# EAGLE design powerblade_test (EAGLE 6.5.0)

## Sheet 1 of 5: AC-DC Power Supply
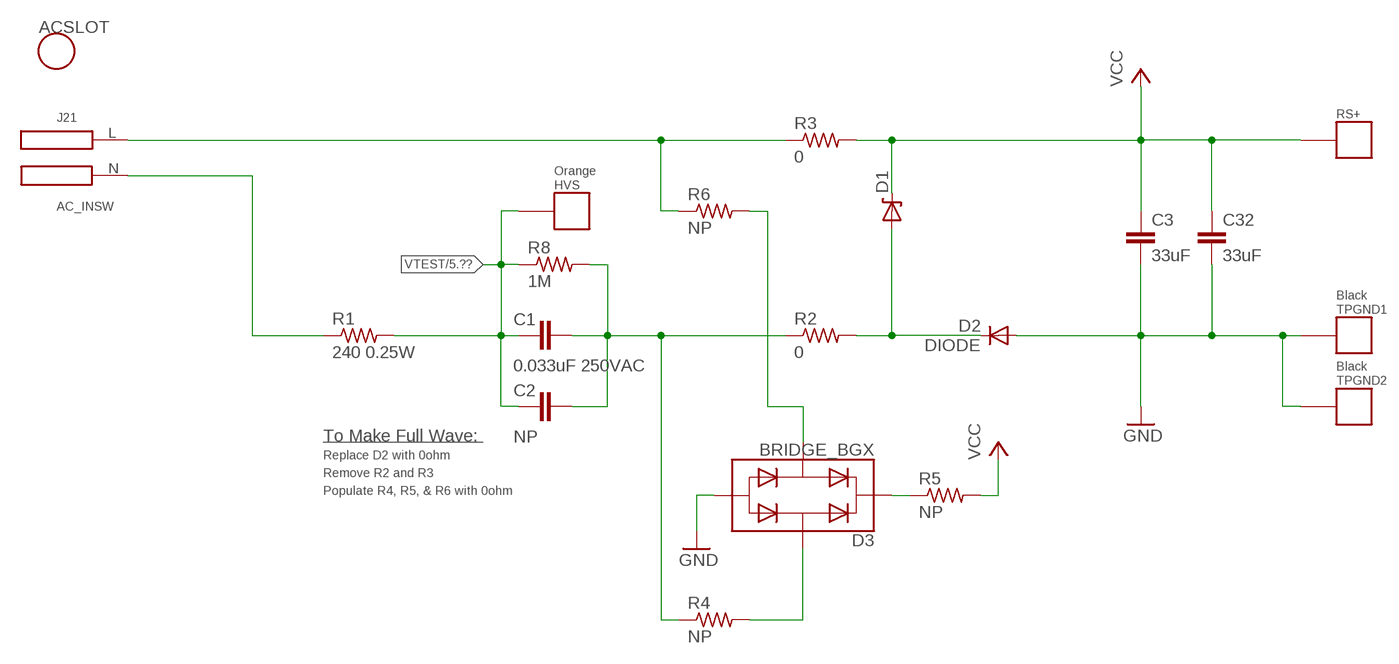
[diagram p0: schematic, sheet 1]

### Parts
ACSLOT  AC_NODIM  [AC3_NODIM]
C1  0.033uF 250VAC  C-EUC2220K  [C2220K]
C2  NP  C-EUC2220K  [C2220K]
C3  33uF  C-EUC0603  [C0603]
C32  33uF  C-EUC0603  [C0603]
D1  ZENERBZT52  [BZT52]
D2  DIODE  [BAS521]
D3  BRIDGE_BGX  [TO-253-4]
HVS  TP_MULT  [TP_MULT]
J21  AC_INSW  [AC_DC21]
R1  240 0.25W  R-US_R0603  [R0603]
R2  0  R-US_R0603  [R0603]
R3  0  R-US_R0603  [R0603]
R4  NP  R-US_R0603  [R0603]
R5  NP  R-US_R0603  [R0603]
R6  NP  R-US_R0603  [R0603]
R8  1M  R-US_R0603  [R0603]
RS+  TP_MULT  [TP_MULT]
TPGND1  TP_MULT  [TP_MULT]
TPGND2  TP_MULT  [TP_MULT]

### Nets
GND: C3.2 C32.2 D2.A D3.P3 TPGND1.P$1 TPGND2.P$1 ; also sheet 2,3,4,5
N: J21.N R1.1
N$3: D1.A D2.C R2.2
N$4: C1.1 C2.1 R2.1 R4.1 R8.2
N$5: D3.P4 R4.2
N$7: D3.P1 R5.1
N$8: D3.P2 R6.2
P: J21.L(P) R3.1 R6.1
VCC: C3.1 C32.1 D1.C R3.2 R5.2 RS+.P$1 ; also sheet 2,3
VTEST: C1.2 C2.2 HVS.P$1 R1.2 R8.1 ; also sheet 5

### Notes on the sheet
- Orange
- Black
- Black
- To Make Full Wave:
- Replace D2 with 0ohm
- Remove R2 and R3
- Populate R4, R5, & R6 with 0ohm

## Sheet 2 of 5: Load Supply Regulation
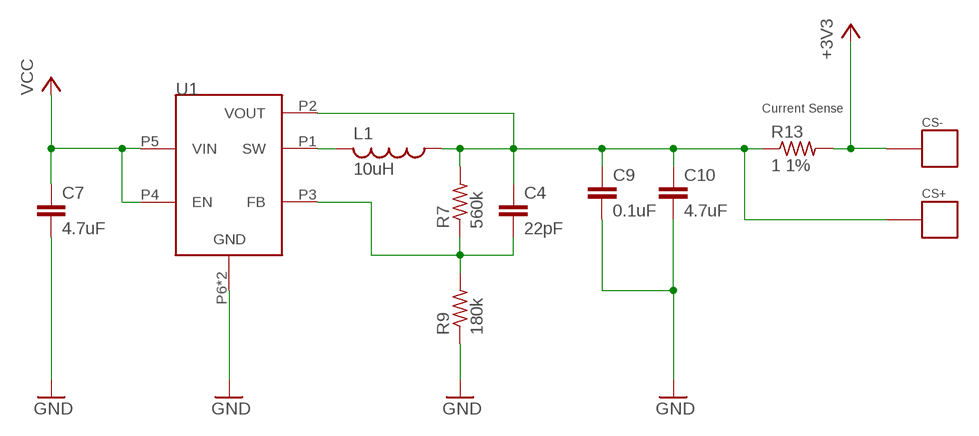
[diagram p1: schematic, sheet 2]

### Parts
C4  22pF  C-EUC0402  [C0402]
C7  4.7uF  C-EUC0603  [C0603]
C9  0.1uF  C-EUC0402  [C0402]
C10  4.7uF  C-EUC0402  [C0402]
CS+  TP_MULT  [TP_MULT]
CS-  TP_MULT  [TP_MULT]
L1  10uH  L-USL0805  [L0805]
R7  560k  R-US_R0402  [R0402]
R9  180k  R-US_R0402  [R0402]
R13  1 1%  R-US_R0603  [R0603]
U1  TPS62122  [WDFN-6]

### Nets
+3V3: CS-.P$1 R13.2 ; also sheet 3,4,5
GND: C7.2 C9.2 C10.2 R9.1 U1.P6(GND) U1.PAD(GND) ; also sheet 1,3,4,5
N$9: L1.2 U1.P1(SW)
N$11: C4.1 C9.1 C10.1 CS+.P$1 L1.1 R7.2 R13.1 U1.P2(VOUT)
N$13: C4.2 R7.1 R9.2 U1.P3(FB)
VCC: C7.1 U1.P4(EN) U1.P5(VIN) ; also sheet 1,3

### Notes on the sheet
- Current Sense

## Sheet 3 of 5: Load 1: TR1000
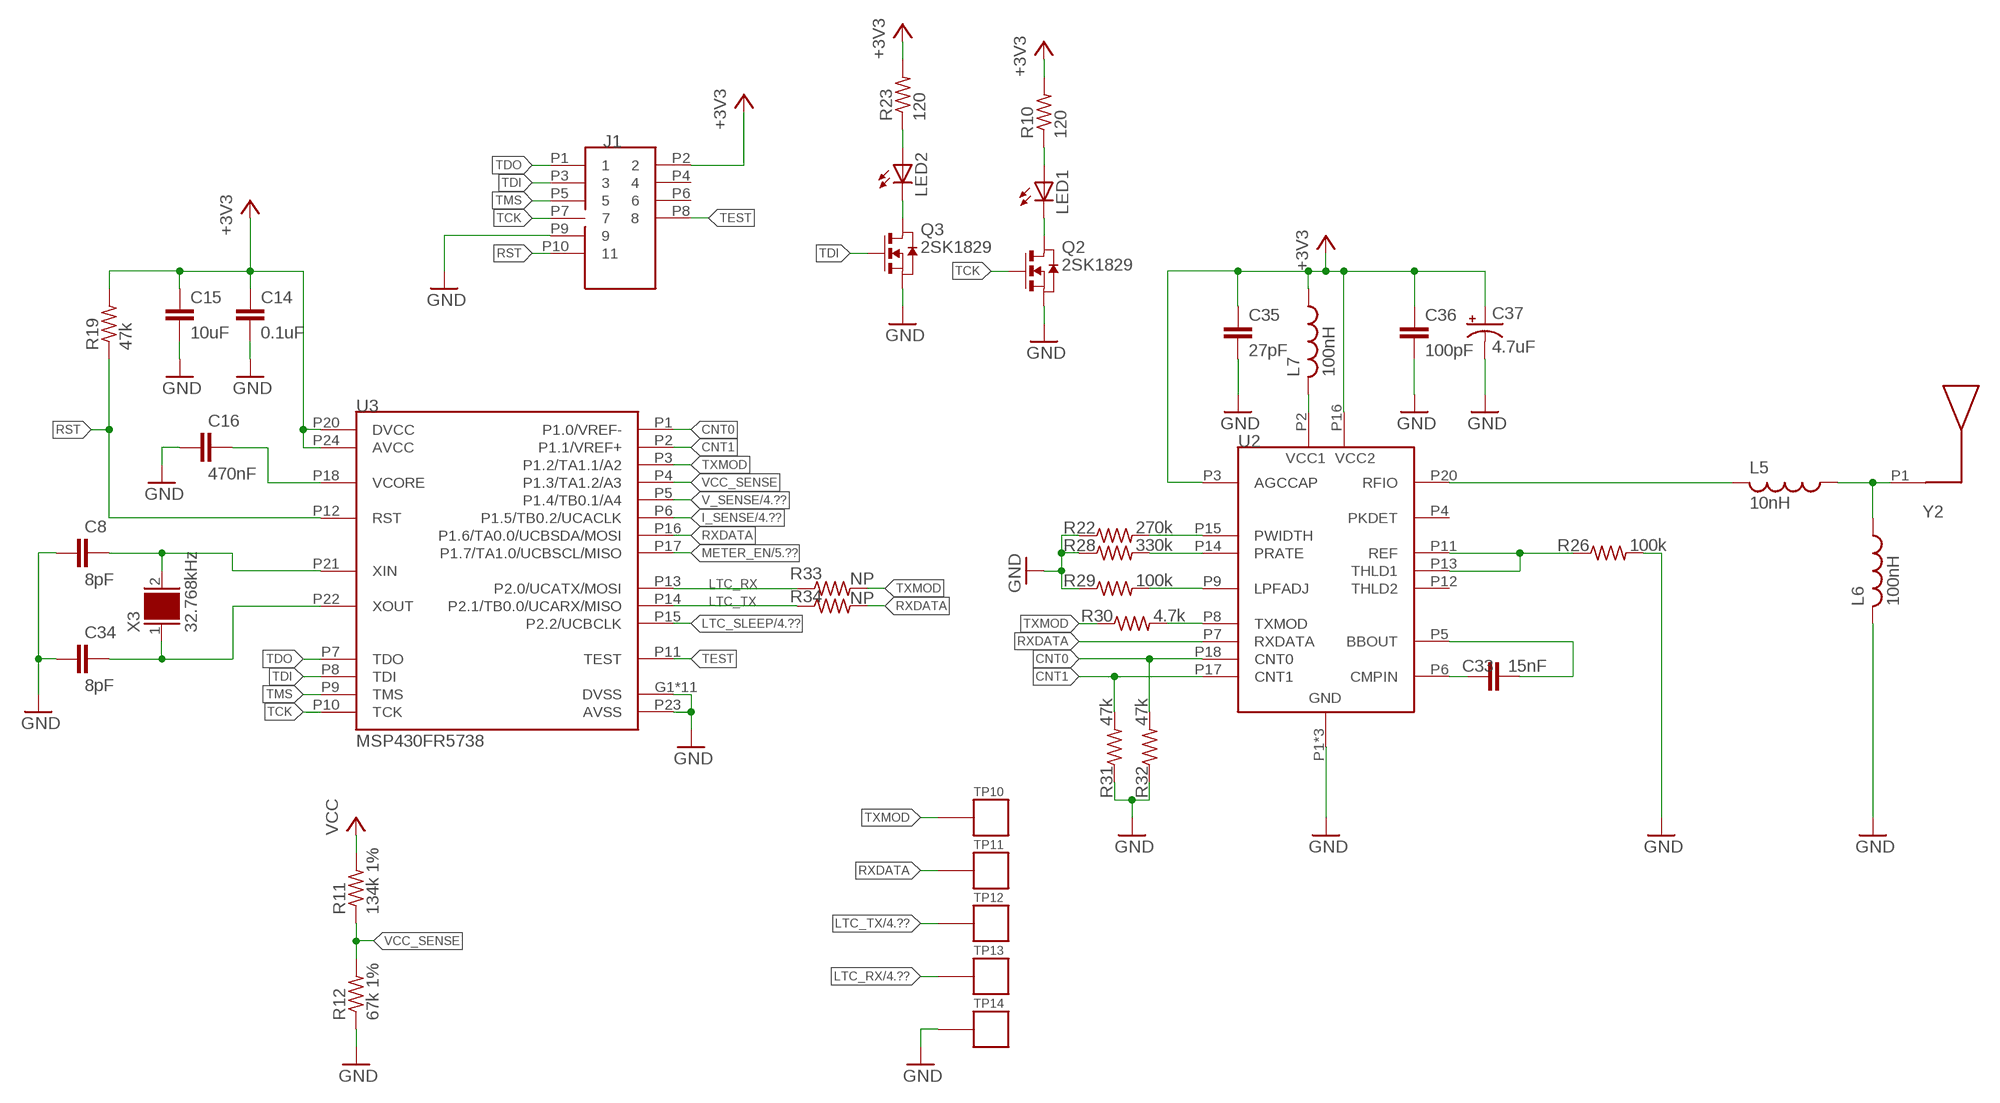
[diagram p2: schematic, sheet 3]

### Parts
C8  8pF  C-EUC0603  [C0603]
C14  0.1uF  C-EUC0603  [C0603]
C15  10uF  C-EUC0603  [C0603]
C16  470nF  C-EUC0603  [C0603]
C33  15nF  C-EUC0603  [C0603]
C34  8pF  C-EUC0603  [C0603]
C35  27pF  C-EUC0603  [C0603]
C36  100pF  C-EUC0603  [C0603]
C37  4.7uF  CPOL-US0805  [CPOL-0805]
J1  JTAG_14PIN_IDC  [TC2050-IDC-430]
L5  10nH  L-USL0402  [L0402]
L6  100nH  L-USL0402  [L0402]
L7  100nH  L-USL0603  [L0603]
LED1  LED0603  [LED-0603]
LED2  LED0603  [LED-0603]
Q2  2SK1829  [SC-70-3]
Q3  2SK1829  [SC-70-3]
R10  120  R-US_R0603  [R0603]
R11  134k 1%  R-US_R0603  [R0603]
R12  67k 1%  R-US_R0603  [R0603]
R19  47k  R-US_R0603  [R0603]
R22  270k  R-US_R0603  [R0603]
R23  120  R-US_R0603  [R0603]
R26  100k  R-US_R0603  [R0603]
R28  330k  R-US_R0603  [R0603]
R29  100k  R-US_R0603  [R0603]
R30  4.7k  R-US_R0603  [R0603]
R31  47k  R-US_R0603  [R0603]
R32  47k  R-US_R0603  [R0603]
R33  NP  R-US_R0603  [R0603]
R34  NP  R-US_R0603  [R0603]
TP10  TP_STD  [TP]
TP11  TP_STD  [TP]
TP12  TP_STD  [TP]
TP13  TP_STD  [TP]
TP14  TP_STD  [TP]
U2  TR1000  [SM-20H]
U3  MSP430FR5738  [VQFN-24]
X3  32.768kHz  CRYSTAL_0805  [0805]
Y2  ANT-916  [ANT-916]

### Nets
+3V3: C14.1 C15.1 C35.1 C36.1 C37.+ J1.P2 L7.1 R10.2 R19.2 R23.2 U2.P3(AGCCAP) U2.P16(VCC2) U3.P20(DVCC) U3.P24(AVCC) ; also sheet 2,4,5
CNT0: R32.2 U2.P18(CNT0) U3.P1(P1.0/VREF-)
CNT1: R31.2 U2.P17(CNT1) U3.P2(P1.1/VREF+)
GND: C8.1 C14.2 C15.2 C16.1 C34.1 C35.2 C36.2 C37.- J1.P9 L6.2 Q2.P2(S) Q3.P2(S) R12.1 R22.1 R26.2 R28.1 R29.1 R31.1 R32.1 TP14.P$1 U2.P1(GND) U2.P10(GND) U2.P19(GND) U3.G1(DVSS) U3.G2(DVSS) U3.G3(DVSS) U3.G4(DVSS) U3.G5(DVSS) U3.G6(DVSS) U3.G7(DVSS) U3.G8(DVSS) U3.G9(DVSS) U3.P19(DVSS) U3.P23(AVSS) U3.PAD(DVSS) ; also sheet 1,2,4,5
I_SENSE: U3.P6(P1.5/TB0.2/UCACLK) ; also sheet 4,5
LTC_RX: R33.1 TP13.P$1 U3.P13(P2.0/UCATX/MOSI) ; also sheet 4
LTC_SLEEP: U3.P15(P2.2/UCBCLK) ; also sheet 4
LTC_TX: R34.1 TP12.P$1 U3.P14(P2.1/TB0.0/UCARX/MISO) ; also sheet 4
METER_EN: U3.P17(P1.7/TA1.0/UCBSCL/MISO) ; also sheet 5
N$1: C34.2 U3.P22(XOUT) X3.1
N$12: C33.2 U2.P5(BBOUT)
N$16: L7.2 U2.P2(VCC1)
N$23: C16.2 U3.P18(VCORE)
N$49: LED1.A R10.1
N$50: R22.2 U2.P15(PWIDTH)
N$51: R28.2 U2.P14(PRATE)
N$52: R29.2 U2.P9(LPFADJ)
N$53: R30.2 U2.P8(TXMOD)
N$54: LED1.C Q2.P3(D)
N$55: C33.1 U2.P6(CMPIN)
N$56: C8.2 U3.P21(XIN) X3.2
N$57: R26.1 U2.P11(REF) U2.P13(THLD1)
N$58: LED2.A R23.1
N$59: LED2.C Q3.P3(D)
N$62: L5.2 U2.P20(RFIO)
N$63: L5.1 L6.1 Y2.P1
RST: J1.P10 R19.1 U3.P12(RST)
RXDATA: R34.2 TP11.P$1 U2.P7(RXDATA) U3.P16(P1.6/TA0.0/UCBSDA/MOSI)
TCK: J1.P7 Q2.P1(G) U3.P10(TCK)
TDI: J1.P3 Q3.P1(G) U3.P8(TDI)
TDO: J1.P1 U3.P7(TDO)
TEST: J1.P8 U3.P11(TEST)
TMS: J1.P5 U3.P9(TMS)
TXMOD: R30.1 R33.2 TP10.P$1 U3.P3(P1.2/TA1.1/A2)
V_SENSE: U3.P5(P1.4/TB0.1/A4) ; also sheet 4,5
VCC: R11.2 ; also sheet 1,2
VCC_SENSE: R11.1 R12.2 U3.P4(P1.3/TA1.2/A3)
Unconnected: J1.P4 J1.P6 U2.P4(PKDET) U2.P12(THLD2)

## Sheet 4 of 5: Load 2: LTC5800
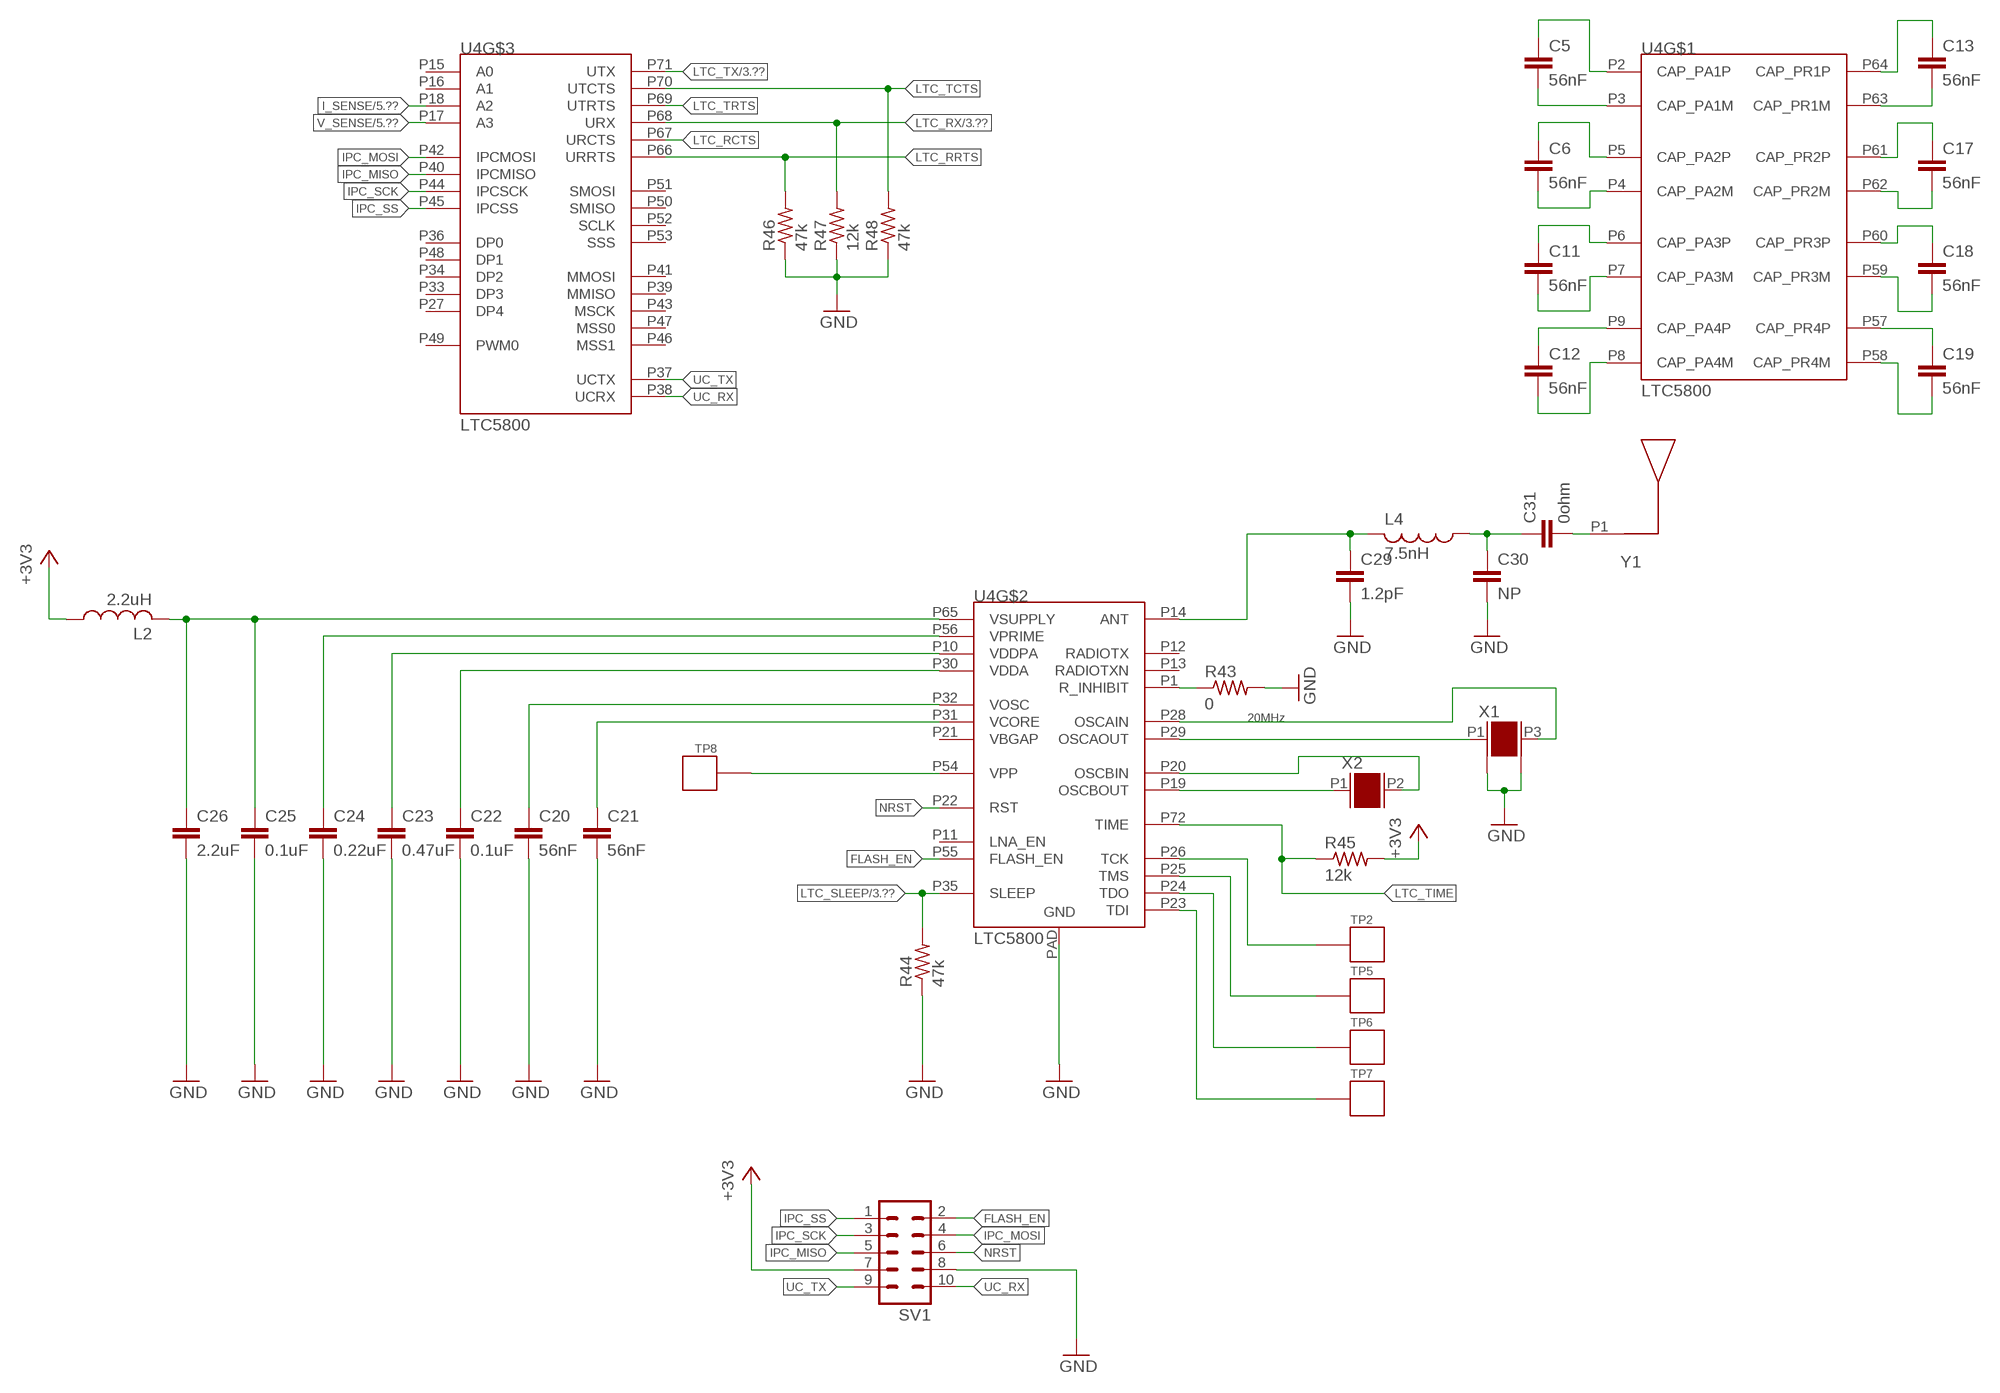
[diagram p3: schematic, sheet 4]

### Parts
C5  56nF  C-EUC0402  [C0402]
C6  56nF  C-EUC0402  [C0402]
C11  56nF  C-EUC0402  [C0402]
C12  56nF  C-EUC0402  [C0402]
C13  56nF  C-EUC0402  [C0402]
C17  56nF  C-EUC0402  [C0402]
C18  56nF  C-EUC0402  [C0402]
C19  56nF  C-EUC0402  [C0402]
C20  56nF  C-EUC0402  [C0402]
C21  56nF  C-EUC0402  [C0402]
C22  0.1uF  C-EUC0603  [C0603]
C23  0.47uF  C-EUC0603  [C0603]
C24  0.22uF  C-EUC0603  [C0603]
C25  0.1uF  C-EUC0603  [C0603]
C26  2.2uF  C-EUC0603  [C0603]
C29  1.2pF  C-EUC0402  [C0402]
C30  NP  C-EUC0402  [C0402]
C31  0ohm  C-EUC0402  [C0402]
L2  2.2uH  L-USL0603  [L0603]
L4  7.5nH  L-USL0402  [L0402]
R43  0  R-US_R0402  [R0402]
R44  47k  R-US_R0402  [R0402]
R45  12k  R-US_R0402  [R0402]
R46  47k  R-US_R0402  [R0402]
R47  12k  R-US_R0402  [R0402]
R48  47k  R-US_R0402  [R0402]
SV1  MA05-2KEY  [MA05-2_KEY]
TP2  TP_SMD  [TP_SMD]
TP5  TP_SMD  [TP_SMD]
TP6  TP_SMD  [TP_SMD]
TP7  TP_SMD  [TP_SMD]
TP8  TP_STD  [TP]
U4  LTC5800  [QFN-72]
X1  ABM8G  [ABM8G]
X2  ABS07  [ABS07]
Y1  UREACH_XTEND  [UREACH_XTEND]

### Nets
+3V3: L2.1 R45.2 SV1.7 ; also sheet 2,3,5
FLASH_EN: SV1.2 U4.P55(FLASH_EN)
GND: C20.2 C21.2 C22.2 C23.2 C24.2 C25.2 C26.2 C29.2 C30.2 R43.2 R44.1 R46.1 R47.1 R48.1 SV1.8 U4.PAD(GND) X1.P2(G1) X1.P4(G2) ; also sheet 1,2,3,5
I_SENSE: U4.P18(A2) ; also sheet 3,5
IPC_MISO: SV1.5 U4.P40(IPCMISO)
IPC_MOSI: SV1.4 U4.P42(IPCMOSI)
IPC_SCK: SV1.3 U4.P44(IPCSCK)
IPC_SS: SV1.1 U4.P45(IPCSS)
LTC_RCTS: U4.P67(URCTS)
LTC_RRTS: R46.2 U4.P66(URRTS)
LTC_RX: R47.2 U4.P68(URX) ; also sheet 3
LTC_SLEEP: R44.2 U4.P35(SLEEP) ; also sheet 3
LTC_TCTS: R48.2 U4.P70(UTCTS)
LTC_TIME: R45.1 U4.P72(TIME)
LTC_TRTS: U4.P69(UTRTS)
LTC_TX: U4.P71(UTX) ; also sheet 3
N$10: C5.1 U4.P2(CAP_PA1P)
N$14: C5.2 U4.P3(CAP_PA1M)
N$15: C6.1 U4.P5(CAP_PA2P)
N$17: C6.2 U4.P4(CAP_PA2M)
N$18: C11.1 U4.P6(CAP_PA3P)
N$19: C11.2 U4.P7(CAP_PA3M)
N$20: C12.1 U4.P9(CAP_PA4P)
N$21: C12.2 U4.P8(CAP_PA4M)
N$22: C13.1 U4.P64(CAP_PR1P)
N$24: C13.2 U4.P63(CAP_PR1M)
N$25: C17.1 U4.P61(CAP_PR2P)
N$26: C17.2 U4.P62(CAP_PR2M)
N$27: C18.1 U4.P60(CAP_PR3P)
N$28: C18.2 U4.P59(CAP_PR3M)
N$29: C19.1 U4.P57(CAP_PR4P)
N$30: C19.2 U4.P58(CAP_PR4M)
N$31: C21.1 U4.P31(VCORE)
N$32: C20.1 U4.P32(VOSC)
N$33: C25.1 C26.1 L2.2 U4.P65(VSUPPLY)
N$34: C24.1 U4.P56(VPRIME)
N$35: C23.1 U4.P10(VDDPA)
N$36: C22.1 U4.P30(VDDA)
N$42: U4.P29(OSCAOUT) X1.P1
N$43: U4.P28(OSCAIN) X1.P3(P2)
N$44: U4.P20(OSCBIN) X2.P2
N$45: U4.P19(OSCBOUT) X2.P1
N$46: C29.1 L4.2 U4.P14(ANT)
N$47: C30.1 C31.1 L4.1
N$48: C31.2 Y1.P1
N$60: TP8.P$1 U4.P54(VPP)
N$72: TP7.P$1 U4.P23(TDI)
N$73: TP6.P$1 U4.P24(TDO)
N$74: TP5.P$1 U4.P25(TMS)
N$75: TP2.P$1 U4.P26(TCK)
N$76: R43.1 U4.P1(R_INHIBIT)
NRST: SV1.6 U4.P22(RST)
UC_RX: SV1.10 U4.P38(UCRX)
UC_TX: SV1.9 U4.P37(UCTX)
V_SENSE: U4.P17(A3) ; also sheet 3,5
Unconnected: U4.P11(LNA_EN) U4.P12(RADIOTX) U4.P13(RADIOTXN) U4.P15(A0) U4.P16(A1) U4.P21(VBGAP) U4.P27(DP4) U4.P33(DP3) U4.P34(DP2) U4.P36(DP0) U4.P39(MMISO) U4.P41(MMOSI) U4.P43(MSCK) U4.P46(MSS1) U4.P47(MSS0) U4.P48(DP1) U4.P49(PWM0) U4.P50(SMISO) U4.P51(SMOSI) U4.P52(SCLK) U4.P53(SSS)

### Notes on the sheet
- 20MHz

## Sheet 5 of 5: Power Measurement
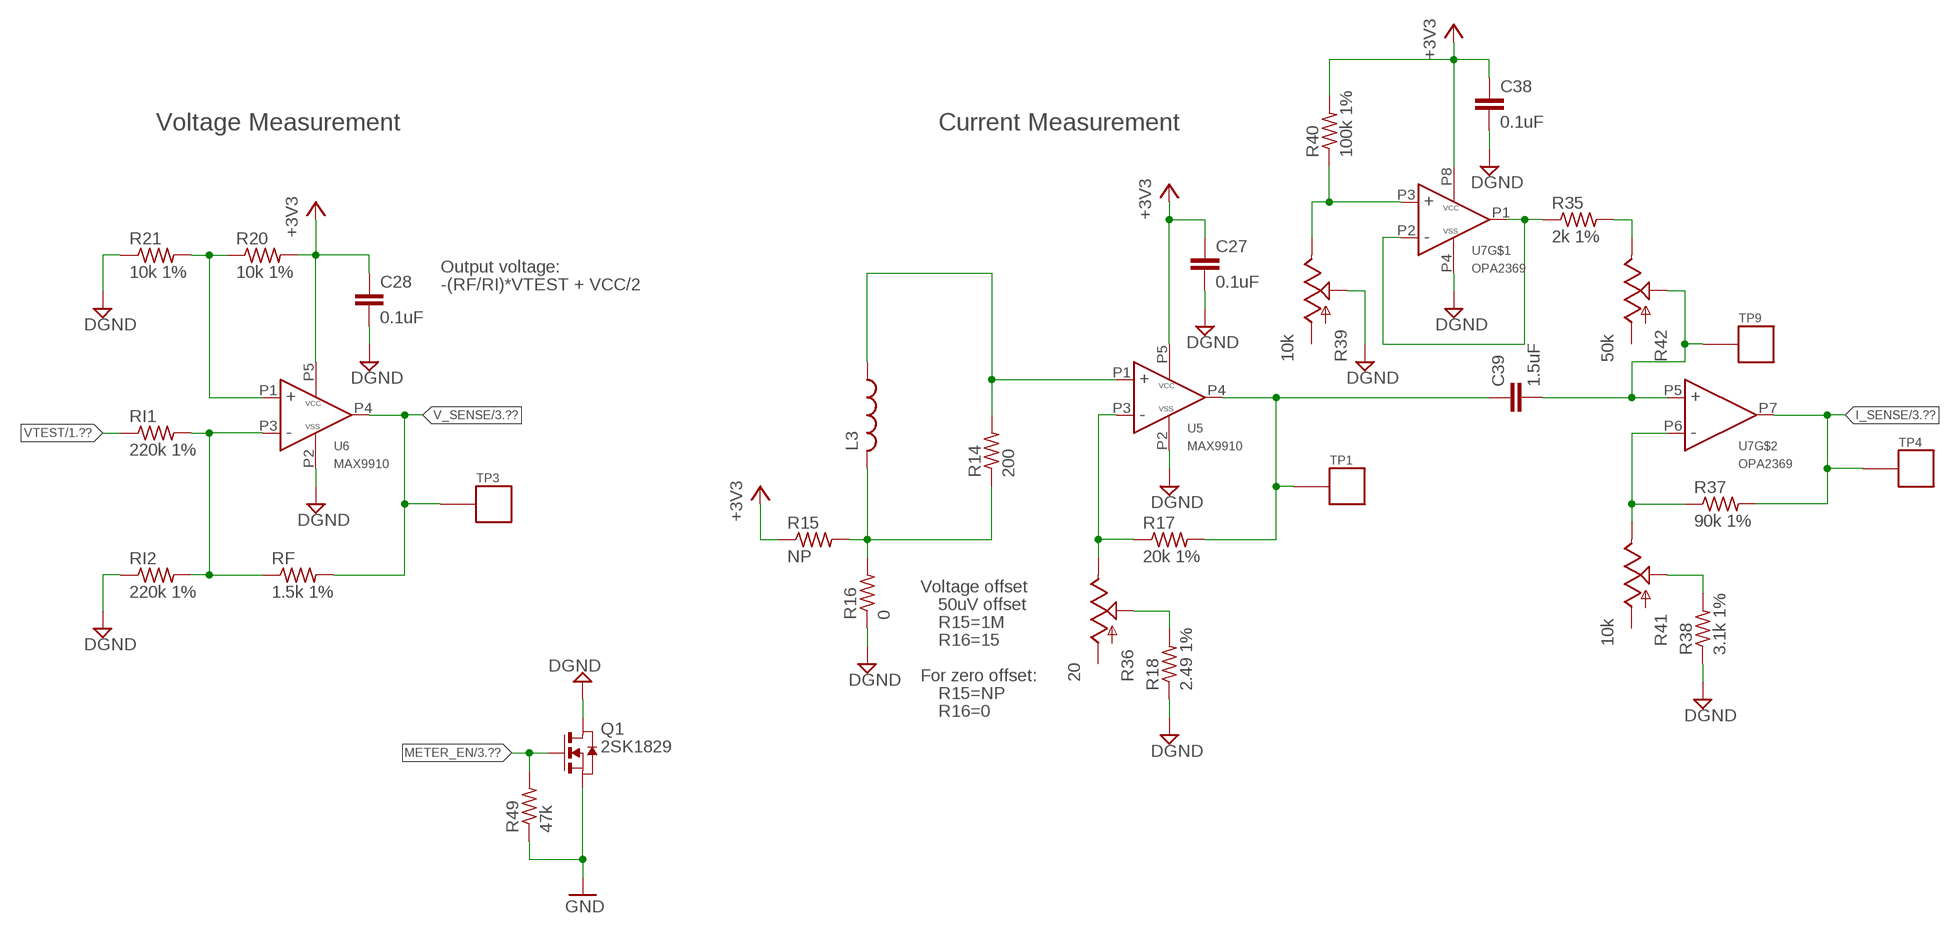
[diagram p4: schematic, sheet 5]

### Parts
C27  0.1uF  C-EUC0402  [C0402]
C28  0.1uF  C-EUC0402  [C0402]
C38  0.1uF  C-EUC0402  [C0402]
C39  1.5uF  C-EUC0402  [C0402]
L3  L-USL0805  [L0805]
Q1  2SK1829  [SC-70-3]
R14  200  R-US_R0402  [R0402]
R15  NP  R-US_R0402  [R0402]
R16  0  R-US_R0402  [R0402]
R17  20k 1%  R-US_R0402  [R0402]
R18  2.49 1%  R-US_R0402  [R0402]
R20  10k 1%  R-US_R0402  [R0402]
R21  10k 1%  R-US_R0402  [R0402]
R35  2k 1%  R-US_R0402  [R0402]
R36  20  3313_POT  [3313_POT]
R37  90k 1%  R-US_R0402  [R0402]
R38  3.1k 1%  R-US_R0603  [R0603]
R39  10k  3313_POT  [3313_POT]
R40  100k 1%  R-US_R0402  [R0402]
R41  10k  3313_POT  [3313_POT]
R42  50k  3313_POT  [3313_POT]
R49  47k  R-US_R0603  [R0603]
RF  1.5k 1%  R-US_R0402  [R0402]
RI1  220k 1%  R-US_R0402  [R0402]
RI2  220k 1%  R-US_R0402  [R0402]
TP1  TP_MULT  [TP_MULT]
TP3  TP_MULT  [TP_MULT]
TP4  TP_MULT  [TP_MULT]
TP9  TP_MULT  [TP_MULT]
U5  MAX9910  [SC70-5]
U6  MAX9910  [SC70-5]
U7  OPA2369  [SOT-23-8]

### Nets
+3V3: C27.1 C28.1 C38.1 R15.1 R20.2 R40.2 U5.P5(VCC) U6.P5(VCC) U7.P8(VCC) ; also sheet 2,3,4
DGND: C27.2 C28.2 C38.2 Q1.P3(D) R16.1 R18.1 R21.1 R38.1 R39.PW RI2.1 U5.P2(VSS) U6.P2(VSS) U7.P4(VSS)
GND: Q1.P2(S) R49.1 ; also sheet 1,2,3,4
I_SENSE: R37.2 TP4.P$1 U7.P7(OUT) ; also sheet 3,4
METER_EN: Q1.P1(G) R49.2 ; also sheet 3
N$37: L3.2 R14.1 R15.2 R16.2
N$38: L3.1 R14.2 U5.P1(IN+)
N$39: R17.1 R36.P2 U5.P3(IN-)
N$40: R20.1 R21.2 U6.P1(IN+)
N$41: RF.1 RI1.2 RI2.2 U6.P3(IN-)
N$61: C39.1 R17.2 TP1.P$1 U5.P4(OUT)
N$65: R18.2 R36.PW
N$66: R37.1 R41.P2 U7.P6(IN-)
N$67: C39.2 R42.PW TP9.P$1 U7.P5(IN+)
N$68: R35.1 U7.P1(OUT) U7.P2(IN-)
N$69: R38.2 R41.PW
N$70: R39.P2 R40.1 U7.P3(IN+)
N$71: R35.2 R42.P2
V_SENSE: RF.2 TP3.P$1 U6.P4(OUT) ; also sheet 3,4
VTEST: RI1.1 ; also sheet 1
Unconnected: R36.P1 R39.P1 R41.P1 R42.P1

### Notes on the sheet
- Voltage Measurement | Current Measurement
- Output voltage:
- -(RF/RI)*VTEST + VCC/2
- Voltage offset
- 50uV offset
- R15=1M
- R16=15
- For zero offset:
- R15=NP
- R16=0

## Library data of the parts
ACSLOT = powerfilm:AC_NODIM; DIGIKEY: NP
C1 = rcl:C-EU: CAPACITOR, European symbol; DIGIKEY: 490-5919-1-ND
C2 C30 = rcl:C-EU: CAPACITOR, European symbol; DIGIKEY: NP
C3 C32 = rcl:C-EU: CAPACITOR, European symbol; DIGIKEY: 718-1672-1-ND
C4 = rcl:C-EU: CAPACITOR, European symbol; DIGIKEY: 1276-1116-1-ND
C5 C6 C11-C13 C17-C21 = rcl:C-EU: CAPACITOR, European symbol; DIGIKEY: 490-6324-1-ND
C7 = rcl:C-EU: CAPACITOR, European symbol; DIGIKEY: 1276-1784-1-ND
C8 C34 = rcl:C-EU: CAPACITOR, European symbol; DIGIKEY: 1276-1817-1-ND
C9 = rcl:C-EU: CAPACITOR, European symbol; DIGIKEY: 1276-1001-1-ND
C10 = rcl:C-EU: CAPACITOR, European symbol; DIGIKEY: 490-5915-1-ND
C14 C22 C25 = rcl:C-EU: CAPACITOR, European symbol; DIGIKEY: 445-1316-1-ND
C15 = rcl:C-EU: CAPACITOR, European symbol; DIGIKEY: 1276-1119-1-ND
C16 = rcl:C-EU: CAPACITOR, European symbol; DIGIKEY: 445-5192-1-ND
C23 = rcl:C-EU: CAPACITOR, European symbol; DIGIKEY: 1276-2377-1-ND
C24 = rcl:C-EU: CAPACITOR, European symbol; DIGIKEY: 445-1318-1-ND
C26 = rcl:C-EU: CAPACITOR, European symbol; DIGIKEY: 1276-2368-1-ND
C27 C28 C38 = rcl:C-EU: CAPACITOR, European symbol; DIGIKEY: 445-1265-1-ND
C29 = rcl:C-EU: CAPACITOR, European symbol; DIGIKEY: 490-6209-1-ND
C31 = rcl:C-EU: CAPACITOR, European symbol; DIGIKEY: P0.0JCT-ND
C33 = rcl:C-EU: CAPACITOR, European symbol; DIGIKEY: 445-5091-1-ND
C35 = rcl:C-EU: CAPACITOR, European symbol; DIGIKEY: 445-1274-1-ND
C36 = rcl:C-EU: CAPACITOR, European symbol; DIGIKEY: 445-1281-1-ND
C37 = rcl:CPOL-US: POLARIZED CAPACITOR, American symbol; DIGIKEY: 478-8120-1-ND
C39 = rcl:C-EU: CAPACITOR, European symbol; DIGIKEY: 445-13874-1-ND
CS+ = skyspecs:TP; DIGIKEY: 5012K-ND
CS- = skyspecs:TP; DIGIKEY: 5010K-ND
D1 = powerfilm:ZENER; DIGIKEY: NP
D2 = powerfilm:DIODE; DIGIKEY: NP
D3 = powerfilm:BRIDGE_BGX; DIGIKEY: NP
HVS = skyspecs:TP; DIGIKEY: 5013K-ND
J1 = ibat:JTAG_14PIN; DIGIKEY: NP; TAG-CONNECT: TC2050-IDC-430
J21 = powerfilm:AC_IN; DIGIKEY: NP
L1 = rcl:L-US: INDUCTOR, American symbol; DIGIKEY: 490-4990-1-ND
L2 = rcl:L-US: INDUCTOR, American symbol; DIGIKEY: 490-4023-1-ND
L3 = rcl:L-US: INDUCTOR, American symbol; DIGIKEY: 732-3452-1-ND
L4 = rcl:L-US: INDUCTOR, American symbol; DIGIKEY: 490-6760-1-ND
L5 = rcl:L-US: INDUCTOR, American symbol; DIGIKEY: 732-2924-1-ND
L6 = rcl:L-US: INDUCTOR, American symbol; DIGIKEY: CW100505-R10JCT-ND
L7 = rcl:L-US: INDUCTOR, American symbol; DIGIKEY: 587-1566-1-ND
LED1 LED2 = SparkFun-LED:LED: LEDs Standard schematic elements and footprints for 5mm, 3mm, 1206, and 0603 sized LEDs. 5mm - Spark Fun Electronics SKU : COM-00529 (and others); DIGIKEY: 160-1183-1-ND
Q1-Q3 = powerfilm:2SK1829; DIGIKEY: 2SK1829TE85LFCT-ND
R1 = rcl:R-US_: RESISTOR, American symbol; DIGIKEY: RHM240DCT-ND
R2 R3 = rcl:R-US_: RESISTOR, American symbol; DIGIKEY: P0.0GCT-ND
R4-R6 R15 R33 R34 = rcl:R-US_: RESISTOR, American symbol; DIGIKEY: NP
R7 = rcl:R-US_: RESISTOR, American symbol; DIGIKEY: P560KLCT-ND
R8 = rcl:R-US_: RESISTOR, American symbol; DIGIKEY: MCT0603-1.00M-CFCT-ND
R9 = rcl:R-US_: RESISTOR, American symbol; DIGIKEY: P180KLCT-ND
R10 R23 = rcl:R-US_: RESISTOR, American symbol; DIGIKEY: P120GCT-ND
R11 = rcl:R-US_: RESISTOR, American symbol; DIGIKEY: P133KHCT-ND
R12 = rcl:R-US_: RESISTOR, American symbol; DIGIKEY: P66.5KHCT-ND
R13 = rcl:R-US_: RESISTOR, American symbol; DIGIKEY: P1.0AJCT-ND
R14 = rcl:R-US_: RESISTOR, American symbol; DIGIKEY: P200LCT-ND
R16 R43 = rcl:R-US_: RESISTOR, American symbol; DIGIKEY: P0.0JCT-ND
R17 = rcl:R-US_: RESISTOR, American symbol; DIGIKEY: P20.0KLCT-ND
R18 = rcl:R-US_: RESISTOR, American symbol; DIGIKEY: 541-2.49LLCT-ND
R19 R31 R32 R49 = rcl:R-US_: RESISTOR, American symbol; DIGIKEY: P47KGCT-ND
R20 R21 = rcl:R-US_: RESISTOR, American symbol; DIGIKEY: P10.0KLCT-ND
R22 = rcl:R-US_: RESISTOR, American symbol; DIGIKEY: P270KGCT-ND
R26 R29 = rcl:R-US_: RESISTOR, American symbol; DIGIKEY: P100KGCT-ND
R28 = rcl:R-US_: RESISTOR, American symbol; DIGIKEY: P330KGCT-ND
R30 = rcl:R-US_: RESISTOR, American symbol; DIGIKEY: P4.7KGCT-ND
R35 = rcl:R-US_: RESISTOR, American symbol; DIGIKEY: P2.00KLCT-ND
R36 = powerfilm:3313_POT; DIGIKEY: 3313J-1-200ECT-ND
R37 = rcl:R-US_: RESISTOR, American symbol; DIGIKEY: P90.9KLCT-ND
R38 = rcl:R-US_: RESISTOR, American symbol; DIGIKEY: P3.09KHCT-ND
R39 R41 = powerfilm:3313_POT; DIGIKEY: 3313J-103ECT-ND
R40 = rcl:R-US_: RESISTOR, American symbol; DIGIKEY: P100KLCT-ND
R42 = powerfilm:3313_POT; DIGIKEY: 3313J-503ECT-ND
R44 R46 R48 = rcl:R-US_: RESISTOR, American symbol; DIGIKEY: P47KJCT-ND
R45 R47 = rcl:R-US_: RESISTOR, American symbol; DIGIKEY: P12KJCT-ND
RF = rcl:R-US_: RESISTOR, American symbol; DIGIKEY: P1.50KLCT-ND
RI1 RI2 = rcl:R-US_: RESISTOR, American symbol; DIGIKEY: P220KLCT-ND
RS+ = skyspecs:TP; DIGIKEY: 5014K-ND
SV1 = con-lstb:MA05-2: PIN HEADER; DIGIKEY: WM18560-ND
TP1 TP4 TP9 = skyspecs:TP; DIGIKEY: 5126K-ND
TP2 TP5-TP8 TP10-TP14 = skyspecs:TP; DIGIKEY: NP
TP3 = skyspecs:TP; DIGIKEY: 5129K-ND
TPGND1 TPGND2 = skyspecs:TP; DIGIKEY: 5011K-ND
U1 = powerfilm:TPS62122; DIGIKEY: 296-27695-1-ND
U2 = powerfilm:TR1000; DIGIKEY: 583-1088-1-ND
U3 = powerfilm:MSP430FR5738; DIGIKEY: 296-29232-1-ND
U4 = powerfilm:LTC5800; DIGIKEY: LTC5800IWR-IPMA#PBF-ND
U5 U6 = powerfilm:MAX9910; DIGIKEY: MAX9910EXK+TCT-ND
U7 = powerfilm:OPA2369; DIGIKEY: 296-22671-1-ND
X1 = powerfilm:ABM8G; DIGIKEY: 535-10293-1-ND
X2 = powerfilm:ABS07; DIGIKEY: 535-12058-1-ND
X3 = general:CRYSTAL_0805; DIGIKEY: 535-12373-1-ND
Y1 = powerfilm:UREACH_XTEND; FRACTUS: FR05-S1-N-0-110
Y2 = powerfilm:ANT-916; DIGIKEY: ANT-916-CHP-TCT-ND

## Board
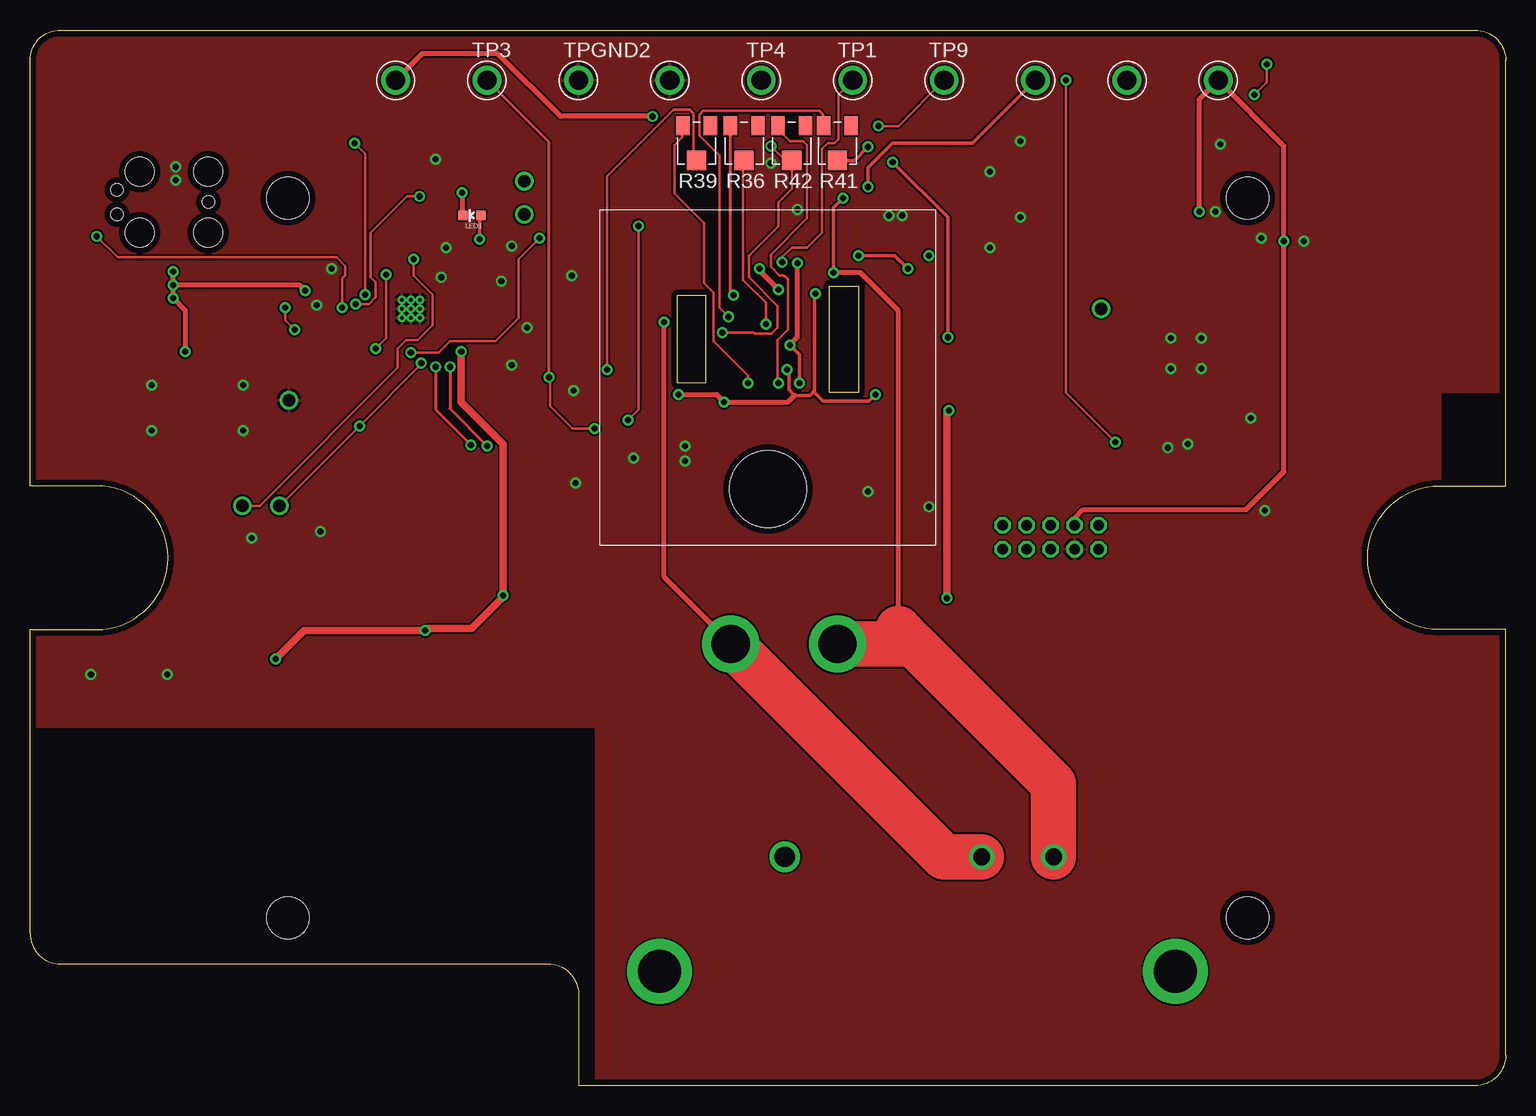
[diagram p5: board, top side]
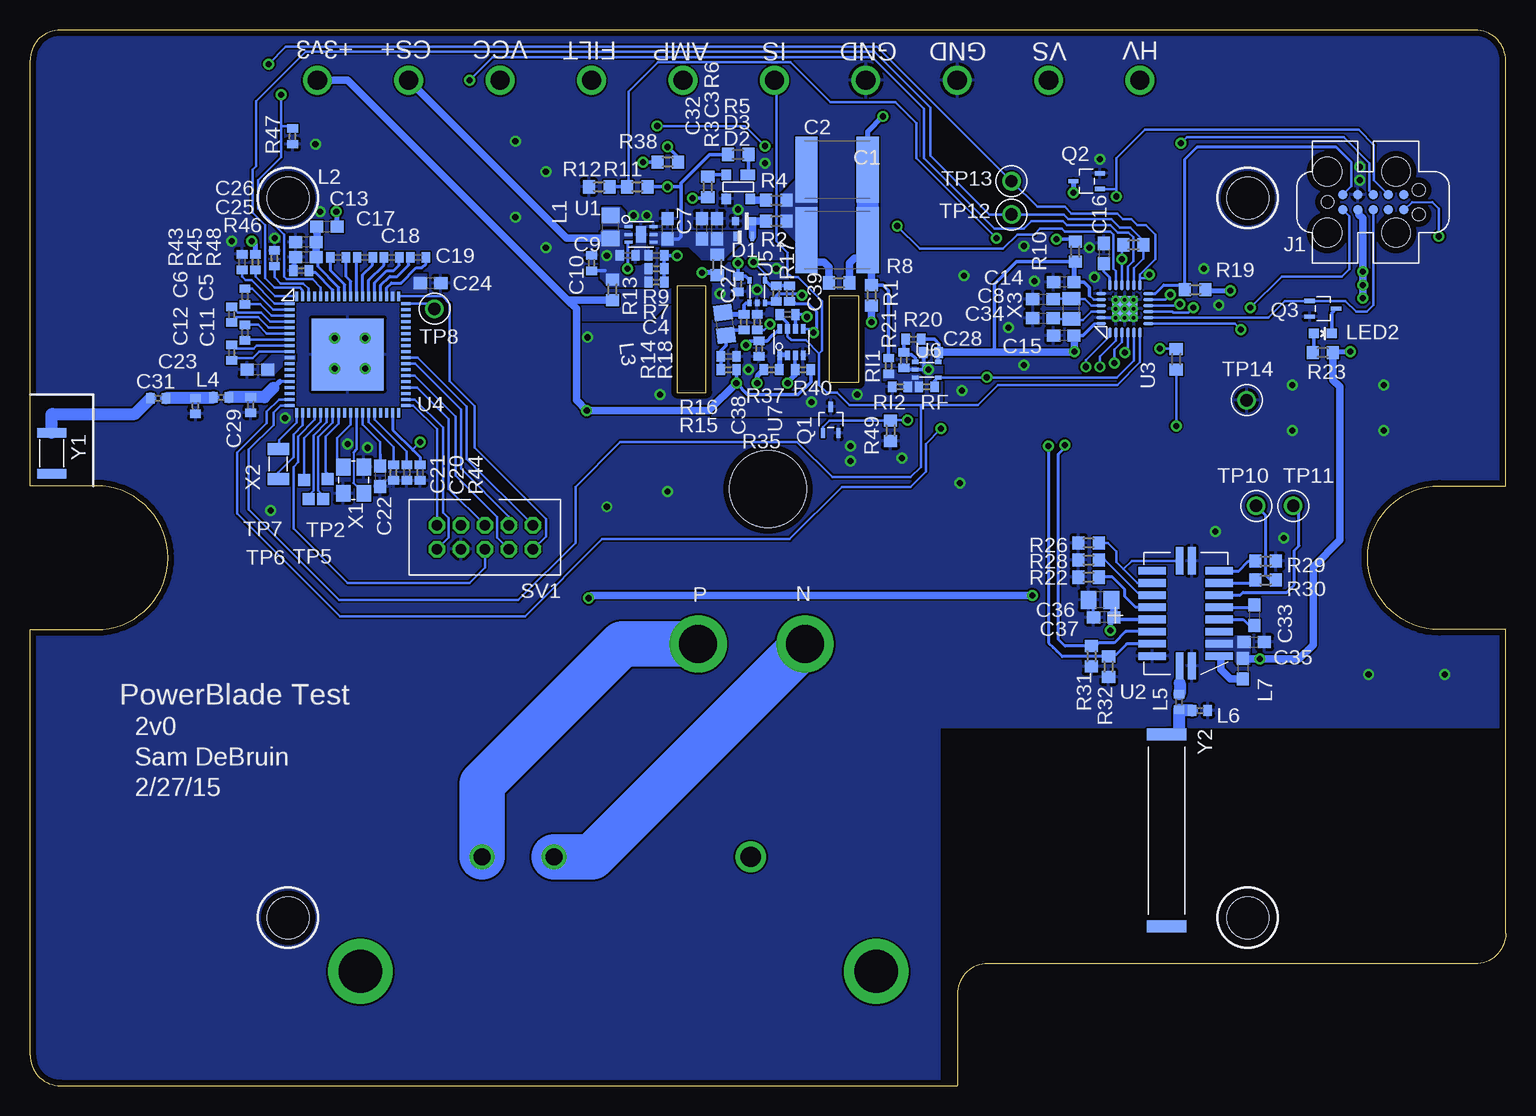
[diagram p6: board, bottom side, seen from below]

Size 123.01 x 88.01 mm. Coordinates in mm from the lower left corner, seen from the top.
Outline: 0,85.47 arc-90 2.54,88.01 120.47,88.01 arc-90 123.01,85.47 123.01,50 117.5,50 arc90 111.51,44.01 arc90 117.5,38.01 123.01,38.01 123.01,2.54 arc-90 120.47,0 45.72,0 45.72,7.62 arc90 43.18,10.16 2.54,10.16 arc-90 0,12.7 0,38.01 5.51,38.01 arc90 11.51,44.01 arc90 5.51,50 0,50 0,85.47
Copper layers (1*16): Top 0.0178mm / dielectric 59mil / Bottom 0.0178mm
Design rules "SSC-EAGLE-2Lyr_v1.0.0.3": minimum track width 6mil, minimum drill 14mil, track to track 6mil, track to pad 6mil, pad to pad 6mil, via to via 6mil, smd to smd 6mil, copper to edge 20mil, drill to drill 16mil, minimum pad ring 8mil, minimum via ring 8mil, stop-mask expansion 3mil, vias tented up to drill 0mil, thermal gap 10mil
Holes 3.5 mm at 101.5,74 101.5,14 21.5,14 21.5,74
tRestrict: area 0,0 to 47,29.7; area 117.8,49.9 to 123.2,57.6
bRestrict: area 0,0 to 47,29.7; area 117.8,49.9 to 123.2,57.6

### Footprints (pad centres in the part's own frame; a part is rotated, then mirrored left to right if it is on the bottom)
AC3_NODIM = hole 6.4: 0,-12.5
C2220K = smd 1.85 x 5.5: 1 -2.55,0; 2 2.55,0
C0603 = smd 1.1 x 1: 1 -0.85,0; 2 0.85,0
C0402 = smd 0.7 x 0.9: 1 -0.65,0; 2 0.65,0
CPOL-0805 = smd 1.3 x 1.5: + -0.95,0; - 0.95,0
TP_MULT = drill 1.6: P$1 0,0
BZT52 = smd 0.3 x 0.8: A -0.7,0; C 0.7,0
BAS521 = smd 0.6 x 0.7: A -0.7,0; C 0.7,0
TO-253-4 = smd 1.2 x 0.9: P1 -0.8,-1 | smd 0.8 x 0.9: P2 1,-1; P3 1,1; P4 -1,1
TC2050-IDC-430 = smd 0.787 x 0.787: P1 -2.54,-0.635; P2 -1.27,-0.635; P3 0,-0.635; P4 1.27,-0.635; P5 2.54,-0.635; P6 2.54,0.635; P7 1.27,0.635; P8 0,0.635; P9 -1.27,0.635; P10 -2.54,0.635 | hole 1.029: -3.81,0; 3.81,1.016; 3.81,-1.016 | hole 2.375: -3.81,2.54; -3.81,-2.54; 1.905,-2.54; 1.905,2.54
AC_DC21 = drill 1.4: L -11.35,9.55; N -5.35,9.55 | drill 3.6: M1 21.5,0; M2 -21.5,0 | drill 1.7: PE 11.05,9.55
L0805 = smd 1.3 x 1.5: 1 -0.95,0; 2 0.95,0
L0603 = smd 1.1 x 1: 1 -0.85,0; 2 0.85,0
L0402 = smd 0.7 x 0.9: 1 -0.65,0; 2 0.65,0
LED-0603 = smd 0.8 x 0.8: A 0,-0.75; C 0,0.75
SC-70-3 = smd 0.85 x 0.35: P1 -1.1,0.65; P2 -1.1,-0.65; P3 1.1,0
R0603 = smd 1 x 1.1: 1 -0.85,0; 2 0.85,0
R0402 = smd 0.7 x 0.9: 1 -0.65,0; 2 0.65,0
3313_POT = smd 1.1 x 1.6: P1 -1.15,-1.45; P2 1.15,-1.45 | smd 1.6 x 1.6: PW 0,1.45
MA05-2_KEY = drill 0.9 octagon: 1 -4,-1; 2 -4,1; 3 -2,-1; 4 -2,1; 5 0,-1; 6 0,1; 7 2,-1; 8 2,1; 9 4,-1; 10 4,1
TP_SMD = smd 1 x 1: P$1 0,0
TP = drill 1.029: P$1 0,0
WDFN-6 = smd 0.65 x 0.25: P1 -1.05,0.65; P2 -1.05,0; P3 -1.05,-0.65; P4 1.05,-0.65; P5 1.05,0; P6 1.05,0.65 | smd 0.8 x 1.4: PAD 0,0
SM-20H = smd 0.635 x 2.286: P1 -0.508,4.381; P10 -0.508,-4.381; P11 0.508,-4.381; P20 0.508,4.381 | smd 2.286 x 0.635: P2 -2.794,3.556; P3 -2.794,2.54; P4 -2.794,1.524; P5 -2.794,0.508; P6 -2.794,-0.508; P7 -2.794,-1.524; P8 -2.794,-2.54; P9 -2.794,-3.556; P12 2.794,-3.556; P13 2.794,-2.54; P14 2.794,-1.524; P15 2.794,-0.508; P16 2.794,0.508; P17 2.794,1.524; P18 2.794,2.54; P19 2.794,3.556
VQFN-24 = drill 0.3 pad 0.5: G1 -0.75,0.75; G2 0,0.75; G3 0.75,0.75; G4 -0.75,0; G5 0,0; G6 0.75,0; G7 -0.75,-0.75; G8 0,-0.75; G9 0.75,-0.75 | smd 0.85 x 0.28: P1 -1.975,1.25; P2 -1.975,0.75; P3 -1.975,0.25; P4 -1.975,-0.25; P5 -1.975,-0.75; P6 -1.975,-1.25; P13 1.975,-1.25; P14 1.975,-0.75; P15 1.975,-0.25; P16 1.975,0.25; P17 1.975,0.75; P18 1.975,1.25 | smd 0.28 x 0.85: P7 -1.25,-1.975; P8 -0.75,-1.975; P9 -0.25,-1.975; P10 0.25,-1.975; P11 0.75,-1.975; P12 1.25,-1.975; P19 1.25,1.975; P20 0.75,1.975; P21 0.25,1.975; P22 -0.25,1.975; P23 -0.75,1.975; P24 -1.25,1.975 | smd 2.1 x 2.1: PAD 0,0
QFN-72 = smd 0.8 x 0.25: P1 -4.85,4.25; P2 -4.85,3.75; P3 -4.85,3.25; P4 -4.85,2.75; P5 -4.85,2.25; P6 -4.85,1.75; P7 -4.85,1.25; P8 -4.85,0.75; P9 -4.85,0.25; P10 -4.85,-0.25; P11 -4.85,-0.75; P12 -4.85,-1.25; P13 -4.85,-1.75; P14 -4.85,-2.25; P15 -4.85,-2.75; P16 -4.85,-3.25; P17 -4.85,-3.75; P18 -4.85,-4.25; P37 4.85,-4.25; P38 4.85,-3.75; P39 4.85,-3.25; P40 4.85,-2.75; P41 4.85,-2.25; P42 4.85,-1.75; P43 4.85,-1.25; P44 4.85,-0.75; P45 4.85,-0.25; P46 4.85,0.25; P47 4.85,0.75; P48 4.85,1.25; P49 4.85,1.75; P50 4.85,2.25; P51 4.85,2.75; P52 4.85,3.25; P53 4.85,3.75; P54 4.85,4.25 | smd 0.25 x 0.8: P19 -4.25,-4.85; P20 -3.75,-4.85; P21 -3.25,-4.85; P22 -2.75,-4.85; P23 -2.25,-4.85; P24 -1.75,-4.85; P25 -1.25,-4.85; P26 -0.75,-4.85; P27 -0.25,-4.85; P28 0.25,-4.85; P29 0.75,-4.85; P30 1.25,-4.85; P31 1.75,-4.85; P32 2.25,-4.85; P33 2.75,-4.85; P34 3.25,-4.85; P35 3.75,-4.85; P36 4.25,-4.85; P55 4.25,4.85; P56 3.75,4.85; P57 3.25,4.85; P58 2.75,4.85; P59 2.25,4.85; P60 1.75,4.85; P61 1.25,4.85; P62 0.75,4.85; P63 0.25,4.85; P64 -0.25,4.85; P65 -0.75,4.85; P66 -1.25,4.85; P67 -1.75,4.85; P68 -2.25,4.85; P69 -2.75,4.85; P70 -3.25,4.85; P71 -3.75,4.85; P72 -4.25,4.85 | smd 6 x 6: PAD 0,0
SC70-5 = smd 0.55 x 0.35: P1 -0.95,0.65; P2 -0.95,0; P3 -0.95,-0.65; P4 0.95,-0.65; P5 0.95,0.65
SOT-23-8 = smd 0.8 x 0.4: P1 -1.1,0.975; P2 -1.1,0.325; P3 -1.1,-0.325; P4 -1.1,-0.975; P5 1.1,-0.975; P6 1.1,-0.325; P7 1.1,0.325; P8 1.1,0.975
ABM8G = smd 1.4 x 1.2: P1 -1.1,-0.85; P2 1.1,-0.85; P3 1.1,0.85; P4 -1.1,0.85
ABS07 = smd 1 x 1.8: P1 -1.25,0; P2 1.25,0
0805 = smd 1.1 x 1.5: 1 -0.85,0; 2 0.85,0
UREACH_XTEND = smd 0.8 x 2.4: NC 1.7,0; P1 -1.7,0
ANT-916 = smd 1.016 x 3.302: M1 8.001,0; P1 -8.001,0

### Placement (x,y rotation side)
ACSLOT  61.51,62.23 0 top
C1  55.72,70.48 0 bottom
C2  55.72,76.36 0 bottom
C3  65.72,71.44 90 bottom
C4  70.8,66.99 0 bottom
C5  105.09,65.8 270 bottom
C6  106.2,64.29 90 bottom
C7  69.85,71.44 90 bottom
C8  38.58,65.56 0 bottom
C9  73.18,69.22 0 bottom
C10  76.2,68.58 90 bottom
C11  105.09,62.79 270 bottom
C12  106.2,61.12 90 bottom
C13  97.31,69.06 0 bottom
C14  36.83,66.99 180 bottom
C15  36.83,62.55 180 bottom
C16  33.5,69.37 270 bottom
C17  95.09,69.06 180 bottom
C18  92.87,69.06 0 bottom
C19  90.65,69.06 180 bottom
C20  91.6,51.12 270 bottom
C21  92.71,51.12 270 bottom
C22  93.82,50.8 270 bottom
C23  104.06,59.69 180 bottom
C24  89.61,66.91 0 bottom
C25  100.01,69.06 180 bottom
C26  100.01,70.33 180 bottom
C27  63.98,66.83 270 bottom
C28  47.9,61.12 180 bottom
C29  104.62,56.75 270 bottom
C30  109.22,56.67 270 bottom
C31  112.32,57.31 180 bottom
C32  66.99,71.44 90 bottom
C33  20.95,39.21 270 bottom
C34  38.58,63.98 0 bottom
C35  20.95,36.99 0 bottom
C36  33.5,39.05 180 bottom
C37  33.81,40.48 180 bottom
C38  62.23,61.44 270 bottom
C39  59.69,66.04 270 bottom
CS+  91.44,83.82 0 top
CS-  99.06,83.82 0 top
D1  63.5,70.8 180 bottom
D2  63.5,72.07 0 bottom
D3  63.98,74.93 180 bottom
HVS  30.48,83.82 0 top
J1  11.05,73.66 0 bottom
J21  73.98,9.53 0 bottom
L1  74.61,71.6 90 bottom
L2  98.27,71.6 180 bottom
L3  65.11,63.5 277.1 bottom
L4  107.08,57.39 0 bottom
L5  27.23,31.99 90 bottom
L6  25.48,31.27 0 bottom
L7  21.91,34.77 270 bottom
LED1  36.83,72.55 90 top
LED2  15.24,62.71 270 bottom
Q1  56.26,55.5 90 bottom
Q2  34.92,75.41 180 bottom
Q3  15.24,64.77 0 bottom
R1  52.86,65.88 90 bottom
R2  60.8,72.07 180 bottom
R3  65.72,68.42 90 bottom
R4  60.8,73.82 180 bottom
R5  63.98,77.63 180 bottom
R6  66.52,74.93 90 bottom
R7  70.8,68.1 180 bottom
R8  55.56,66.93 180 bottom
R9  70.8,69.22 0 bottom
R10  35.88,69.53 270 bottom
R11  72.39,74.93 0 bottom
R12  75.56,74.93 0 bottom
R13  74.45,66.36 270 bottom
R14  63.5,63.66 90 bottom
R15  64.77,59.69 180 bottom
R16  64.77,60.8 180 bottom
R17  60.8,66.04 90 bottom
R18  62.39,63.66 270 bottom
R19  25.88,66.36 0 bottom
R20  49.37,62.23 0 bottom
R21  50.16,60.48 90 bottom
R22  34.77,42.39 0 bottom
R23  15.24,61.12 0 bottom
R26  34.77,45.24 180 bottom
R28  34.77,43.81 0 bottom
R29  20,43.74 180 bottom
R30  20,42.15 180 bottom
R31  4.99k  [R0603]  34.53,35.8 90 bottom
R32  4.99k  [R0603]  33.1,34.92 90 bottom
R33  27.46,60.56 270 bottom
R34  31.04,70.09 180 bottom
R35  61.2,59.69 180 bottom
R36  59.53,78.58 180 top
R37  59.85,64.29 180 bottom
R38  69.85,76.99 0 bottom
R39  55.56,78.58 180 top
R40  58.58,59.69 0 bottom
R41  67.31,78.58 180 top
R42  63.5,78.58 180 top
R43  105.33,68.66 90 bottom
R44  90.49,51.12 90 bottom
R45  104.22,68.66 90 bottom
R46  33k  [R0402]  100.41,67.94 0 bottom
R47  33k  [R0402]  101.12,79.14 90 bottom
R48  33k  [R0402]  102.63,68.98 270 bottom
R49  51.28,54.61 90 bottom
RF  48.26,58.26 0 bottom
RI1  51.44,60.01 270 bottom
RI2  50.48,58.26 0 bottom
RS+  83.82,83.82 0 top
SV1  85.09,45.72 180 bottom
TP1  68.58,83.82 0 top
TP2  98.19,50.56 0 bottom
TP3  38.1,83.82 0 top
TP4  60.96,83.82 0 top
TP5  98.58,48.9 0 bottom
TP6  99.77,48.9 0 bottom
TP7  100.17,50.48 0 bottom
TP8  89.3,64.77 0 bottom
TP9  76.2,83.82 0 top
TP10  20.8,48.34 0 bottom
TP11  17.7,48.34 0 bottom
TP12  41.2,72.63 0 bottom
TP13  41.2,75.41 0 bottom
TP14  21.59,57.15 0 bottom
TPGND1  53.34,83.82 0 top
TPGND2  45.72,83.82 0 top
U1  72.07,70.96 0 bottom
U2  26.67,39.37 180 bottom
U3  31.75,64.77 90 bottom
U4  96.52,60.96 0 bottom
U5  62.39,66.2 90 bottom
U6  48.26,59.69 0 bottom
U7  59.53,61.99 90 bottom
X1  96.04,50.48 90 bottom
X2  102.31,51.83 270 bottom
X3  36.2,64.77 90 bottom
Y1  121.21,52.73 270 bottom
Y2  28.26,21.27 270 bottom

### Tracks (layer width: path | path; a pad name or v marks a point on that pad's centre or on a via)
+3V3  (via drill 0.51)
  Top 0.305: v64.14,58.58 64.14,60.96 v63.34,61.75
  Top 0.406: v22.94,66.28 22.46,66.75 v11.92,66.75 | v11.92,66.75 v11.92,65.64 12.94,64.63 v12.94,61.2 | v11.92,66.75 v11.92,67.87 | v39.45,40.88 39.45,40.72 | 33.1,38.1 v32.94,37.94 | SV1.7 87.09,47.32 87.79,48.02 101.36,48.02 104.54,51.2 v104.54,70.41 104.54,78.34 CS-.P$1 97.47,82.23 v97.47,72.87 | v63.34,61.75 63.98,62.39 v63.98,68.58 | 76.44,56.12 v76.6,56.28
  Top 0.61: v20.48,35.56 22.86,37.94 v32.94,37.94 | v35.96,61.2 35.96,56.99 39.45,53.5 v39.45,40.88 | 39.45,40.72 36.83,38.1 33.1,38.1 | v76.44,40.64 76.44,56.12
  Bottom 0.203: U3.P20 34.33,65.52 34.69,65.88 | U3.P24 34.27,63.52 34.37,63.42
  Bottom 0.305: R15.1 64.12,58.59 v64.14,58.58 63.18,57.63 58.98,57.63 57.93,58.67 R40.2 | U7.P8 61.14,62.52 61.59,62.07 62.22,62.07 | 62.22,62.07 C38.1 | 62.22,62.07 63.02,62.07 v63.34,61.75 | U5.P5 63.37,67.48 C27.1 v63.98,68.58 | U6.P5 47.31,61.1 C28.1 47.23,61.15 47.23,61.83 47.62,62.23 R20.2 | 34.69,65.88 34.69,66.52 35.16,66.99 C14.1 | 34.37,63.42 35.24,62.55 C15.1 | 35.98,68.58 R10.2 40.78,68.68 42.62,66.83 42.62,61.15 | U2.P16 32.46,38.86 C36.1
  Bottom 0.406: R23.2 14.31,61.2 v12.94,61.2 | R19.2 24.95,66.28 v22.94,66.28 | C14.1 35.98,68.58 36.14,68.74 | 32.46,38.86 32.93,38.9 v32.94,37.94 | R45.2 104.22,70.09 v104.54,70.41 | L2.1 97.42,72.81 v97.47,72.87 | 76.2,40.88 v76.44,40.64
  Bottom 0.61: J1.P2 12.24,72.95 12.24,72.63 11.92,72.31 v11.92,67.87 v11.92,66.75 v11.92,65.64 | C36.1 32.65,40.26 C37.+ | L7.1 21.85,35.56 v20.48,35.56 17.22,35.56 16.03,36.75 16.03,43.26 13.81,45.48 13.81,58.26 14.39,58.84 R23.2 | C15.1 35.96,62.52 v35.96,61.2 36.01,61.15 42.62,61.15 47.23,61.15 | R13.2 78.21,65.51 | 78.21,65.51 96.52,83.82 CS-.P$1 | v64.14,58.58 66.44,56.28 v76.6,56.28 77.47,57.15 77.47,64.77 78.21,65.51 | v39.45,40.88 76.2,40.88
  pour Bottom (no thermals): 24.92,37.47 21.35,37.47 21.35,35.4 21.35,35.16 22.3,35.16 23.5,36.35 24.92,36.35
CNT0  (via drill 0.51)
  Top 0.254: v35,59.93 35,56.44 v38.1,53.34
  Bottom 0.203: U3.P1 33,62.49 35,60.48 v35,59.93
  Bottom 0.254: U2.P18 31.59,36.83 32.54,35.88 33,35.88 R32.2 36.97,35.77 37.42,36.23 37.7,36.51 38.1,36.91 v38.1,53.34
CNT1  (via drill 0.51)
  Top 0.254: v33.81,59.93 33.81,56.36 v36.75,53.42
  Bottom 0.203: U3.P2 32.5,62.12 33.81,60.8 v33.81,59.93
  Bottom 0.254: U2.P17 31.69,37.85 32.62,36.91 33.89,36.91 34.15,36.65 R31.2 36.73,36.65 37.31,37.23 37.31,52.63 36.75,53.18 v36.75,53.42
DGND  (via drill 0.51)
  Top 0.203: R39.PW 55.32,77.37 55.32,81.04 55.01,81.36 53.66,81.36 48.1,75.8 v48.1,59.69
  Top 0.305: v71.91,76.99 76.52,72.39 v76.52,62.39 | v63.1,59.69 63.1,59.37 63.26,59.21 63.26,58.02 63.74,57.55 65.01,57.55 65.41,57.94 | 65.41,57.94 65.41,65.96 v65.48,66.04 | 65.41,57.94 65.41,57.78 66.12,57.07 69.93,57.07 v70.48,57.63
  Top 0.406: v54.05,57.63 57.23,57.63 v57.86,56.99 63.18,56.99 63.74,57.55 | v60.8,68.1 60.8,67.94 v62.39,66.36
  Bottom 0.305: R38.1 v71.91,76.99 | R21.1 50.02,59.69 U6.P2 48.66,59.69 48.5,59.85 48.5,61.06 C28.2
  pour Bottom (rank 5): 46.99,55.88 77.47,55.88 77.47,63.5 71.12,63.5 68.58,66.04 67.31,67.31 66.04,67.31 64.77,68.58 46.99,68.58
FLASH_EN
  Bottom 0.203: U4.P55 88.67,65.81 88.03,65.17 88.03,58.74 85.96,56.67 85.96,53.18 80.01,47.23 80.01,45.8 SV1.2
GND  (via drill 0.51)
  Bottom 0.152: v97.63,59.77 97.63,59.85 U4.PAD
  Bottom 0.203: C25.2 100.86,68.6 100.89,68.58
  Bottom 0.254: U3.P23 U3.G1 | C36.2 34.35,40.06 C37.- | R46.1 101.14,68.33 100.89,68.58 100.89,69.06
  other vias: 72.71,72.55 71.6,72.55 63.98,73.05 12.16,76.6 12.16,75.49 25.16,68.1 23.89,65.09 34.69,69.85 34.29,67.39 33.81,77.23 54.61,52.07 54.61,53.34 24.21,46.2 18.49,45.64 96.52,53.5 95.09,62.31 97.63,62.31 95.09,59.77 98.82,72.87 102.63,70.64 106.2,70.41 94.85,53.18 45.32,57.94 40.16,60.09 41.43,63.18 45.16,67.55 39.29,67.07 40.16,70.01 45.48,50.24 50.32,52.31 102.95,47.94 101.76,55.64 69.85,49.53 74.93,48.26 82.55,72.39 80.01,69.85 80.01,76.2 82.55,78.74 17.78,54.61 17.78,58.42 10.16,58.42 10.16,54.61 11.43,34.29 5.08,34.29 99.22,78.5 61.75,76.91
  pour Top (rank 6): 0,0 124.46,0 124.46,88.9 0,88.9
  pour Bottom (rank 6): 0,0 124.46,0 124.46,88.9 0,88.9
  pour Bottom (no thermals): 72.39,71.6 71.75,71.6 71.75,69.69 71.6,69.53 71.28,69.53 71.28,68.9 72.71,68.9 72.71,69.53 72.55,69.53 72.39,69.69
  pour Bottom: 39.37,69.85 39.37,62.23 52.07,62.23 52.07,69.85
I_SENSE
  Bottom 0.203: U3.P6 30.5,60.3 32.38,58.42 42.31,58.42 43.97,56.75 48.76,56.75 | 48.76,56.75 54.69,56.75 55.72,57.78 56.59,57.78 57.23,58.42 57.23,61.04 | 57.23,61.04 58.34,62.15 59.53,62.15 59.85,62.47 59.85,63.08 U7.P7 | 48.76,56.75 48.76,51.57 49.61,50.72 56.12,50.72 59.05,53.66 73.82,53.66 77.55,49.93 77.55,45.24 82.31,40.48 97.23,40.48 104.78,48.02 104.78,53.02 102.71,55.09 102.71,56.12 102.12,56.71 U4.P18 | TP4.P$1 60.8,83.66 60.8,70.41 59.85,69.45 59.85,67.71 59.53,67.39 58.98,67.39 56.99,65.41 56.99,61.28 57.23,61.04
  Bottom 0.305: U7.P7 59.85,63.1 59.85,63.58 60.5,64.23 R37.2
IPC_MISO
  Bottom 0.203: U4.P40 90.75,58.21 88.11,55.56 88.11,49.74 SV1.5
IPC_MOSI
  Bottom 0.203: U4.P42 90.96,59.21 87.55,55.8 87.55,50.88 84.06,47.39 84.06,45.69 SV1.4
IPC_SCK
  Bottom 0.203: U4.P44 90.93,60.21 87.07,56.36 87.07,51.44 83.11,47.47 83.11,46.74 SV1.3
IPC_SS
  Bottom 0.203: U4.P45 90.71,60.71 86.6,56.59 86.6,52.23 SV1.1
LTC_RRTS
  Bottom 0.254: U4.P66 97.77,66.34 99.22,67.79 99.6,67.79 R46.2
LTC_RX  (via drill 0.51)
  Top 0.203: v103.11,85.17 103.11,83.66 v102.08,82.63 | v29.69,67.63 29.69,62.31 v28.81,61.44
  Bottom 0.203: U4.P68 98.77,66.54 99.46,67.23 101.6,67.23 101.84,67.47 101.84,70.96 103.98,73.1 103.98,75.49 102.08,77.39 102.08,80.01 | U3.P13 30.5,67.31 | 30.5,67.31 30.5,67.61 29.21,68.9 29.21,70.96 30,71.75 30.72,71.75 31.19,72.23 31.91,72.23 32.38,72.71 36.2,72.71 36.75,73.26 39.05,73.26 TP13.P$1 52.39,86.6 101.68,86.6 v103.11,85.17 | v29.69,67.63 30,67.31 30.5,67.31 | v28.81,61.44 27.49,61.44 R33.1 | 102.08,80.01 v102.08,82.63 | R47.2 101.35,80.01 102.08,80.01
LTC_SLEEP  (via drill 0.51)
  Top 0.203: v86.36,83.82 86.36,57.78 v90.49,53.66
  Bottom 0.203: v90.49,53.66 91.08,53.06 91.08,52.98 | U3.P15 31.5,68.27 31.04,68.74 31.04,70.72 31.43,71.12 32.31,71.12 32.94,71.75 36.59,71.75 36.91,72.07 39.53,72.07 40.16,71.44 42.62,71.44 48.5,77.31 48.5,81.44 52.78,85.72 84.45,85.72 v86.36,83.82
  Bottom 0.254: U4.P35 92.77,54.67 91.08,52.98 90.49,52.39 R44.2
LTC_TCTS
  Bottom 0.203: U4.P70 99.77,66.43 100.25,66.87 102.12,66.87 102.63,67.39 R48.2
LTC_TIME
  Bottom 0.203: U4.P72 102.56,65.81 104.22,67.47 R45.1
LTC_TX
  Bottom 0.203: U4.P71 100.27,66.3 100.49,66.52 102.63,66.52 103.43,67.31 103.43,71.75 104.46,72.79 104.46,76.36 104.14,76.68 104.14,82.07 100.01,86.2 52.63,86.2 47.94,81.52 47.94,77.55 43.02,72.63 TP12.P$1 36.83,72.63 36.43,72.23 32.86,72.23 32.15,71.52 31.27,71.52 30.19,70.43 R34.1 30.19,68.95 31,68.14 U3.P14
METER_EN  (via drill 0.51)
  Top 0.203: v50.72,71.68 50.72,56.36 v49.85,55.48
  Bottom 0.203: Q1.P1 56.91,54.93 56.38,55.46 R49.2 51.25,55.48 v49.85,55.48 | U3.P17 32.5,67.9 32.7,68.1 32.7,70.96 32.94,71.2 36.75,71.2 36.99,71.44 38.81,71.44 39.29,70.96 40.72,70.96 41.91,69.77 48.82,69.77 v50.72,71.68 50.48,71.44
N  (via drill 0.51, 3.17)
  Top 0.406: v52.86,63.66 52.86,42.39 v58.42,36.83
  Top 3.81: J21.N 76.17,19.07 v58.42,36.83
  Bottom 0.61: v52.86,63.66 R1.1
  Bottom 3.81: J21.N 76.17,19.07 v58.42,36.83
N$1
  Bottom 0.203: U3.P22 34.54,64.52 35.24,63.82 36.09,63.82 X3.1 37.67,63.92 C34.2
N$3
  Bottom 0.61: R2.2 D2.C D1.A
N$4
  Bottom 0.61: R8.2 56.41,68.24 56.83,68.66 58.34,68.66 58.42,68.58 58.42,70.34 C1.1
  pour Bottom (no thermals): 57.47,67.87 59.05,67.87 59.05,70.33 60.33,71.6 60.33,74.3 59.05,75.56 59.05,78.98 57.47,78.98
N$5
  Bottom 0.61: R4.2 62.87,73.82 D3.P4
N$7
  Bottom 0.305: R5.1 63.13,75.98 D3.P1
N$8
  Bottom 0.305: D3.P2 66.37,75.93 R6.2
N$9
  pour Bottom (no thermals): 72.87,71.6 73.82,71.6 73.98,71.75 75.25,71.75 75.25,73.18 73.82,73.18 72.87,72.23
N$10
  Bottom 0.203: U4.P2 102.73,64.71 104.47,66.45 C5.1
N$11  (via drill 0.51)
  Bottom 0.305: C10.1 75.1,67.93 75.09,67.94
  Bottom 0.61: L1.1 78.27,70.65 CS+.P$1
  other vias: 74.93,69.22
  pour Bottom (rank 2, no thermals): 75.25,71.28 73.03,71.28 72.87,71.12 72.87,70.48 73.03,70.33 73.18,70.33 73.5,70.01 73.5,68.26 72.07,68.26 71.91,68.42 71.28,68.42 71.28,66.67 74.77,66.67 75.41,67.31 75.41,71.12
N$12
  Bottom 0.254: U2.P5 21.88,38.86 21.51,38.5 21.09,38.5 C33.2
N$13  (via drill 0.51)
  Top 0.305: v69.06,69.22 72.07,69.22 v73.18,68.1
  Bottom 0.254: U1.P3 73.18,70.31 v73.18,68.1
  Bottom 0.305: C4.2 R7.1 R9.2 v69.06,69.22
N$14
  Bottom 0.203: U4.P3 102.87,64.21 103.81,65.15 C5.2
N$15
  Bottom 0.203: U4.P5 103.14,63.21 103.98,64.06 105.79,64.06 C6.1
N$16
  Bottom 0.61: L7.2 22.96,33.92 23.73,34.69 23.73,35.67 U2.P2
N$17
  Bottom 0.203: U4.P4 103,63.71 103.74,64.45 105.71,64.45 C6.2
N$18
  Bottom 0.203: U4.P6 103.27,62.71 104,63.44 C11.1
N$19
  Bottom 0.203: U4.P7 105.02,62.21 C11.2
N$20
  Bottom 0.203: U4.P9 103.89,61.21 104.46,60.64 105.95,60.64 C12.1
N$21
  Bottom 0.203: U4.P8 104.1,61.71 104.38,61.44 105.79,61.44 C12.2
N$22
  Bottom 0.254: U4.P64 96.77,66.77 97.95,67.94 97.95,69.04 C13.1
N$23
  Bottom 0.254: U3.P18 33,67.37 33.5,67.87 C16.2
N$24
  Bottom 0.254: U4.P63 96.27,67.06 96.68,67.47 96.68,69.04 C13.2
N$25
  Bottom 0.254: U4.P61 95.27,67.61 94.46,68.42 94.46,69.04 C17.1
N$26
  Bottom 0.254: U4.P62 95.77,69.03 C17.2
N$27
  Bottom 0.254: U4.P60 94.77,67.16 93.5,68.42 93.5,69.04 C18.1
N$28
  Bottom 0.254: U4.P59 94.27,66.94 93.27,67.94 92.71,67.94 92.23,68.42 92.23,69.04 C18.2
N$29
  Bottom 0.254: U4.P57 93.27,66.51 92.87,66.91 92.08,66.91 90.81,68.18 90.33,68.18 90.01,68.5 90.01,69.04 C19.1
N$30
  Bottom 0.254: U4.P58 93.77,66.73 93.03,67.47 92.39,67.47 91.44,68.42 91.44,68.91 C19.2
N$31
  Bottom 0.203: U4.P31 94.77,55.32 92.71,53.26 C21.1
N$32
  Bottom 0.203: C20.1 91.6,52.86 94.27,55.53 U4.P32
N$33
  Bottom 0.254: U4.P65 97.27,66.55 98.98,68.26 98.98,68.87 C25.1
  Bottom 0.61: L2.2 99.12,71.18 99.06,71.12 99.06,70.43 C26.1 C25.1
N$34
  pour Bottom (no thermals): 92.47,65.48 93.11,65.48 93.11,66.52 93.11,66.6 92.79,66.91 92.08,66.91 91.36,67.63 90.01,67.63 90.01,65.88 92.08,65.88
N$35
  pour Bottom (no thermals): 100.97,60.96 102.79,60.96 103.66,60.09 103.66,59.21 102.71,59.21 102.71,59.29 101.76,60.25 100.97,60.25
N$36
  Bottom 0.203: 93.82,52.63 93.82,53.66 95.27,55.11 U4.P30
  Bottom 0.254: 93.82,52.63 C22.1
N$37
  Bottom 0.305: R15.2 R16.2 65.41,60.82 65.41,61.28 65,61.69 L3.2 64.54,63.01 R14.1
N$38
  Bottom 0.305: U5.P1 63.34,65.25 63.5,65.09 R14.2
  Bottom 0.406: L3.1 65.1,64.31 R14.2
N$39  (via drill 0.51)
  Top 0.254: v58.65,65.91 58.38,66.24 R36.P2
  Bottom 0.254: R17.1 60.8,65.88 60.64,66.04 58.74,66.04 v58.65,65.91
  Bottom 0.305: U5.P3 60.94,65.25 R17.1
N$40
  Bottom 0.305: U6.P1 49.21,60.64 49.53,60.96 49.99,60.96 R21.2 50.16,62.09 R20.1
N$41
  pour Bottom (no thermals): 48.66,57.86 50.09,57.86 51.04,58.82 51.83,58.82 51.83,59.61 49.21,59.61 48.66,59.05
N$42
  Bottom 0.152: 96.04,52.78 96.04,50.23
  Bottom 0.203: U4.P29 95.77,53.06 96.04,52.78 | 96.04,50.23 X1.P1
N$43
  Bottom 0.203: U4.P28 96.27,55.1 97.39,53.98 97.39,52.08 X1.P3
N$44
  Bottom 0.203: U4.P20 100.27,55.07 101.04,54.29 101.04,52.39 102.31,51.12 X2.P2
N$45
  Bottom 0.203: U4.P19 100.77,55.28 102.23,53.82 102.23,53.16
  Bottom 0.254: 102.23,53.16 X2.P1
N$46
  Bottom 0.254: U4.P14 102.18,58.71
  Bottom 0.406: 102.18,58.71 102.71,58.18
  Bottom 1.016: 102.71,58.18 103.49,57.4 C29.1 104.63,57.39 L4.2
N$47
  Bottom 1.016: L4.1 107.79,57.32 C30.1 109.23,57.31 C31.1
N$48
  Bottom 1.016: Y1.P1 121.21,55.96 121.16,56.01 114.27,56.01 C31.2
N$49  (via drill 0.51)
  Top 0.305: LED1.A 37.47,72.43 v37.47,70.56
  Bottom 0.305: R10.1 36.06,70.56 v37.47,70.56
N$50
  Bottom 0.254: U2.P15 30.83,39.88 31.75,40.8 31.75,41.35 32.78,42.39 R22.2
N$51
  Bottom 0.203: U2.P14 30.5,40.89 33.42,43.81 R28.2
N$52
  Bottom 0.254: U2.P9 22.24,42.93 21.43,43.74 R29.2
N$53
  Bottom 0.254: U2.P8 21.09,41.91 R30.2
N$54  (via drill 0.51)
  Top 0.406: LED1.C 36.08,74.41 v36.04,74.45
  Bottom 0.203: 36.02,74.47 v36.04,74.45
  Bottom 0.406: Q2.P3 36.02,74.47
N$55
  Bottom 0.254: U2.P6 21.14,39.88 C33.1
N$56
  Bottom 0.203: U3.P21 34.54,65.02 35.08,65.56 36.14,65.56 X3.2 37.67,65.62 C8.2
N$57
  Bottom 0.203: U2.P13 30.72,41.91 31.87,43.06 | 31.87,43.06 32.46,43.66 32.46,44.53 33.18,45.24 R26.1 | U2.P11 31.18,43.75 31.87,43.06
N$58
  Bottom 0.305: LED2.A 15.99,61.22 R23.1
N$59
  Bottom 0.305: LED2.C 14.49,64.42 Q3.P3
N$60
  Bottom 0.203: U4.P54 89.74,65.21 TP8.P$1
N$61  (via drill 0.51)
  Top 0.203: v62.71,68.66 62.71,69.06 63.5,69.85 64.77,69.85 66.04,71.12 66.04,78.11 66.52,78.58 67.07,78.58 67.39,78.9 67.39,82.63 TP1.P$1
  Bottom 0.203: U5.P4 61.74,67.69 v62.71,68.66
  Bottom 0.305: C39.1 R17.2 61.28,66.69 U5.P4
N$62
  Bottom 0.61: U2.P20 27.18,33.54
  Bottom 1.016: 27.18,33.54 27.18,32.69 L5.2
N$63
  Bottom 1.016: Y2.P1 27.16,29.29 27.15,29.29 27.23,29.37 L5.1 27.16,31.27 L6.1
N$65  (via drill 0.51)
  Top 0.203: 59.21,76.81 R36.PW 59.45,77.05 59.45,67.15 61.34,65.26 v61.34,63.48
  Bottom 0.203: R18.2 61.81,63.01 v61.34,63.48
N$66  (via drill 0.51)
  Top 0.203: R41.P2 66.12,80.07 66.12,80.96 65.8,81.28 56.12,81.28 55.8,80.96 55.8,79.22 57.47,77.55 57.47,64.85 v58.22,64.1 v58.23,64.1
  Bottom 0.254: v58.23,64.1 58.39,64.29 R37.1
  Bottom 0.305: R37.1 U7.P6
N$67  (via drill 0.51)
  Top 0.203: v57.71,62.79 60.33,62.79 60.4,62.71 61.83,62.71 62.31,63.18 62.31,65.01 59.93,67.39 59.93,69.22 62.39,71.68 62.39,73.66 63.5,74.77 R42.PW 62.97,77.13 v61.75,78.34 | v70.72,80.01 72.39,80.01 TP9.P$1
  Bottom 0.203: U7.P5 58.02,63.09 v57.71,62.79 | v61.75,78.34 63.42,80.01 v70.72,80.01
  Bottom 0.254: v57.71,62.79 57.47,63.03 57.47,64.53 58.1,65.17 59.13,65.17 59.36,65.39 C39.2
N$68
  Bottom 0.406: U7.P2 U7.P1 60.55,60.85 R35.1
N$69  (via drill 0.51)
  Top 0.305: R41.PW 68.72,77.13 v69.85,78.26
  Bottom 0.305: R38.2 69,77.41 v69.85,78.26
N$70  (via drill 0.51)
  Top 0.203: R39.P2 54.37,79.99 54.37,79.06 53.74,78.42 53.74,74.37 56.2,71.91 56.2,66.91 56.99,66.12 56.99,62.07 59.85,59.21 v59.85,58.58
  Bottom 0.305: 59.86,58.59 v59.85,58.58 | U7.P3 59.23,60.87 R40.1
  Bottom 0.406: 59.86,58.59 59.23,59.23 R40.1
N$71  (via drill 0.51)
  Top 0.203: v62.39,58.58 62.31,58.66 62.31,62.15 63.18,63.02 63.18,67.23 62.87,67.55 62.47,67.55 61.75,68.26 61.75,69.29 64.77,72.31 64.77,78.42 64.45,78.74 63.34,78.74 62.35,79.73 R42.P2
  Bottom 0.406: R35.2 62.39,59.15 v62.39,58.58
N$72
  Bottom 0.203: U4.P23 98.77,55.38 100.17,53.98 TP7.P$1
N$73
  Bottom 0.203: U4.P24 98.27,55.32 99.38,54.21 99.38,49.61 99.77,49.21 TP6.P$1
N$74
  Bottom 0.203: U4.P25 97.77,55.27 98.98,54.05 98.98,49.61 98.58,49.21 TP5.P$1
N$75
  Bottom 0.203: U4.P26 97.27,55.21 98.35,54.13 98.35,51.2 98.19,51.04 TP2.P$1
N$76
  Bottom 0.203: U4.P1 102.6,65.21 104.54,67.15 105.01,67.15 105.33,67.47 R43.1
NRST
  Bottom 0.203: U4.P22 99.27,55.51 100.65,54.13 100.65,51.99 101.04,51.59 101.04,46.43 96.52,41.91 86.36,41.91 85.09,43.18 SV1.6
P  (via drill 0.51, 3.17)
  Top 0.305: v66.99,67.79 66.99,73.18 v67.79,73.98
  Top 0.406: 72.39,38.1 72.39,64.61 69.22,67.79 v66.99,67.79
  Top 3.81: J21.L 85.33,25.16 73.66,36.83 | 73.66,36.83 72.39,38.1 | v67.31,36.83 73.66,36.83
  Bottom 0.305: R6.1 66.62,73.98 v67.79,73.98
  Bottom 0.406: R3.1 65.94,67.79 v66.99,67.79
  Bottom 3.81: J21.L 85.33,25.16 73.66,36.83 v67.31,36.83
RST
  Bottom 0.203: J1.P10 12.88,75.01 12.88,76.99
  Bottom 0.254: U3.P12 29.75,66.04 29.21,66.04 28.5,66.75 27.12,66.75 R19.1 26.73,77.25 25.72,78.26 14.15,78.26 12.88,76.99
RXDATA  (via drill 0.51)
  Top 0.203: TP11.P$1 19.13,48.34 30.64,59.85 30.64,61.44 31.35,62.15 32.31,62.15 33.58,63.42 33.58,65.96 31.99,67.55 v31.99,68.9
  Bottom 0.203: U3.P16 32,68.89 v31.99,68.9 31.99,69.99 R34.2
  Bottom 0.254: U2.P7 22.13,40.89 21.91,41.12 18.26,41.12 17.62,41.75 17.62,44.61 17.22,45.01 17.22,47.86 TP11.P$1
TCK  (via drill 0.51)
  Top 0.203: v27.15,65.17 28.26,65.17 28.81,65.72 28.81,66.99 28.42,67.39 28.42,71.12 31.43,74.14 v32.46,74.14
  Bottom 0.152: J1.P7 10.97,75.49
  Bottom 0.203: 10.97,75.49 10.97,78.42 12.24,79.69 30.08,79.69 32.46,77.31 32.46,74.69 | 32.46,74.69 v32.46,74.14 | U3.P10 27.29,65.02 v27.15,65.17 | Q2.P1 32.53,74.76 32.46,74.69
TDI
  Bottom 0.203: U3.P8 19.8,64.02 18.4,65.42 Q3.P1 13.35,65.42 12.46,64.53 11.59,64.53 11.05,65.07 J1.P3
TDO  (via drill 0.51)
  Top 0.203: v21.27,64.85 21.27,63.82 v22.07,63.02
  Bottom 0.203: J1.P1 13.03,72.47 13.03,68.09 13.65,67.47 18.65,67.47 v21.27,64.85 21.03,65.09 | v22.07,63.02 22.56,63.52 U3.P7
TEST  (via drill 0.51)
  Top 0.203: v27.07,78.58 27.94,77.71 v27.94,65.96
  Bottom 0.203: J1.P8 11.37,74.61 11.37,76.91 13.51,79.06 26.59,79.06 v27.07,78.58 | U3.P11 28.37,65.52 v27.94,65.96
TMS  (via drill 0.51)
  Top 0.203: v5.57,70.8 7.32,69.06 25.56,69.06 26.27,68.34 26.27,67.55 26.04,67.31 v26.04,64.85
  Bottom 0.152: 8.43,73.03 7.8,73.66 6.13,73.66
  Bottom 0.203: J1.P5 8.43,73.03 | 6.13,73.66 5.57,73.1 v5.57,70.8 | U3.P9 27.77,64.52 27.7,64.45 26.43,64.45 v26.04,64.85
TXMOD  (via drill 0.51)
  Top 0.203: v32.62,60.25 32.62,60.17 v27.46,55.01 TP10.P$1
  Bottom 0.203: U3.P3 32,61.98 32.62,61.36 v32.62,60.25 | R33.2 v27.46,55.01
  Bottom 0.254: R30.1 19.61,42.15 20,42.55 20,47.55 TP10.P$1
UC_RX
  Bottom 0.203: U4.P38 90.94,57.21 88.58,54.85 88.58,47.78 88.11,47.31 88.11,45.7 SV1.10
UC_TX
  Bottom 0.203: U4.P37 91.08,56.71 89.09,54.72 SV1.9
V_SENSE  (via drill 0.51)
  Top 0.203: v43.26,59.05 43.34,58.98 43.34,56.67 45.24,54.77 v47.07,54.77
  Top 0.254: v43.26,59.05 43.26,78.66 TP3.P$1
  Bottom 0.203: U3.P5 31,60.44 32.4,59.04 43.18,59.04 U6.P4 | v47.07,54.77 48.34,53.5 48.34,51.2 49.61,49.93 55.32,49.93 59.69,45.56 75.33,45.56 81.76,39.13 97.16,39.13 105.73,47.7 105.73,52.78 103.27,55.24 103.27,56.2 102.25,57.21 U4.P17
  Bottom 0.254: v43.26,59.05 43.2,59.05 43.18,59.04
  Bottom 0.305: U6.P4 47.61,58.74 RF.2
VCC  (via drill 0.51)
  Top 0.305: v69.85,74.93 69.85,76.52 71.91,78.58 78.58,78.58 RS+.P$1
  Bottom 0.305: R5.2 66.36,77.63 68.74,75.25 68.74,74.93 | 68.74,74.93 68.74,70.8 68.95,70.59 C7.1 | R11.2 v69.85,74.93 68.74,74.93
  pour Bottom (no thermals): 71.28,71.12 69.37,71.12 69.37,70.17 71.28,70.17
  pour Bottom (rank 2, no thermals): 70.33,71.12 63.98,71.12 63.98,70.17 65.25,68.9 66.99,68.9 68.1,70.01 70.33,70.01
VCC_SENSE  (via drill 0.51)
  Top 0.203: v31.75,61.12 34.05,61.12 35,62.07 38.81,62.07 40.72,63.98 40.72,68.9 v42.47,70.64
  Bottom 0.203: U3.P4 31.5,61.37 v31.75,61.12 | v42.47,70.64 49.13,77.31 49.13,80.25 50.88,81.99 56.28,81.99 59.61,85.33 70.64,85.33 73.1,82.87 73.1,75.07 R11.1
  Bottom 0.305: R11.1 R12.2
VTEST  (via drill 0.51)
  Top 0.406: v51.91,80.8 44.21,80.8 38.97,86.04 32.7,86.04 HVS.P$1
  Bottom 0.305: RI1.1 51.44,66.28 51.91,66.75 52.31,66.75 52.86,67.31
  Bottom 0.406: C2.2 53.17,79.54 v51.91,80.8
  Bottom 0.61: R8.1 54.71,68.56 54.29,68.98 53.34,68.98 | 53.34,68.98 53.17,68.98 C1.2 | R1.2 52.86,67.31 52.86,68.5 53.34,68.98
  Bottom 1.829: C1.2 C2.2

### Text on the board
bPlace: HV | VS | GND | GND | IS | AMP | FILT | VCC | CS+ | +3v3 | N | P | PowerBlade Test | 2v0 | Sam DeBruin | 2/27/15